# Altium project nova34.PrjPcb (part 1 of 2)
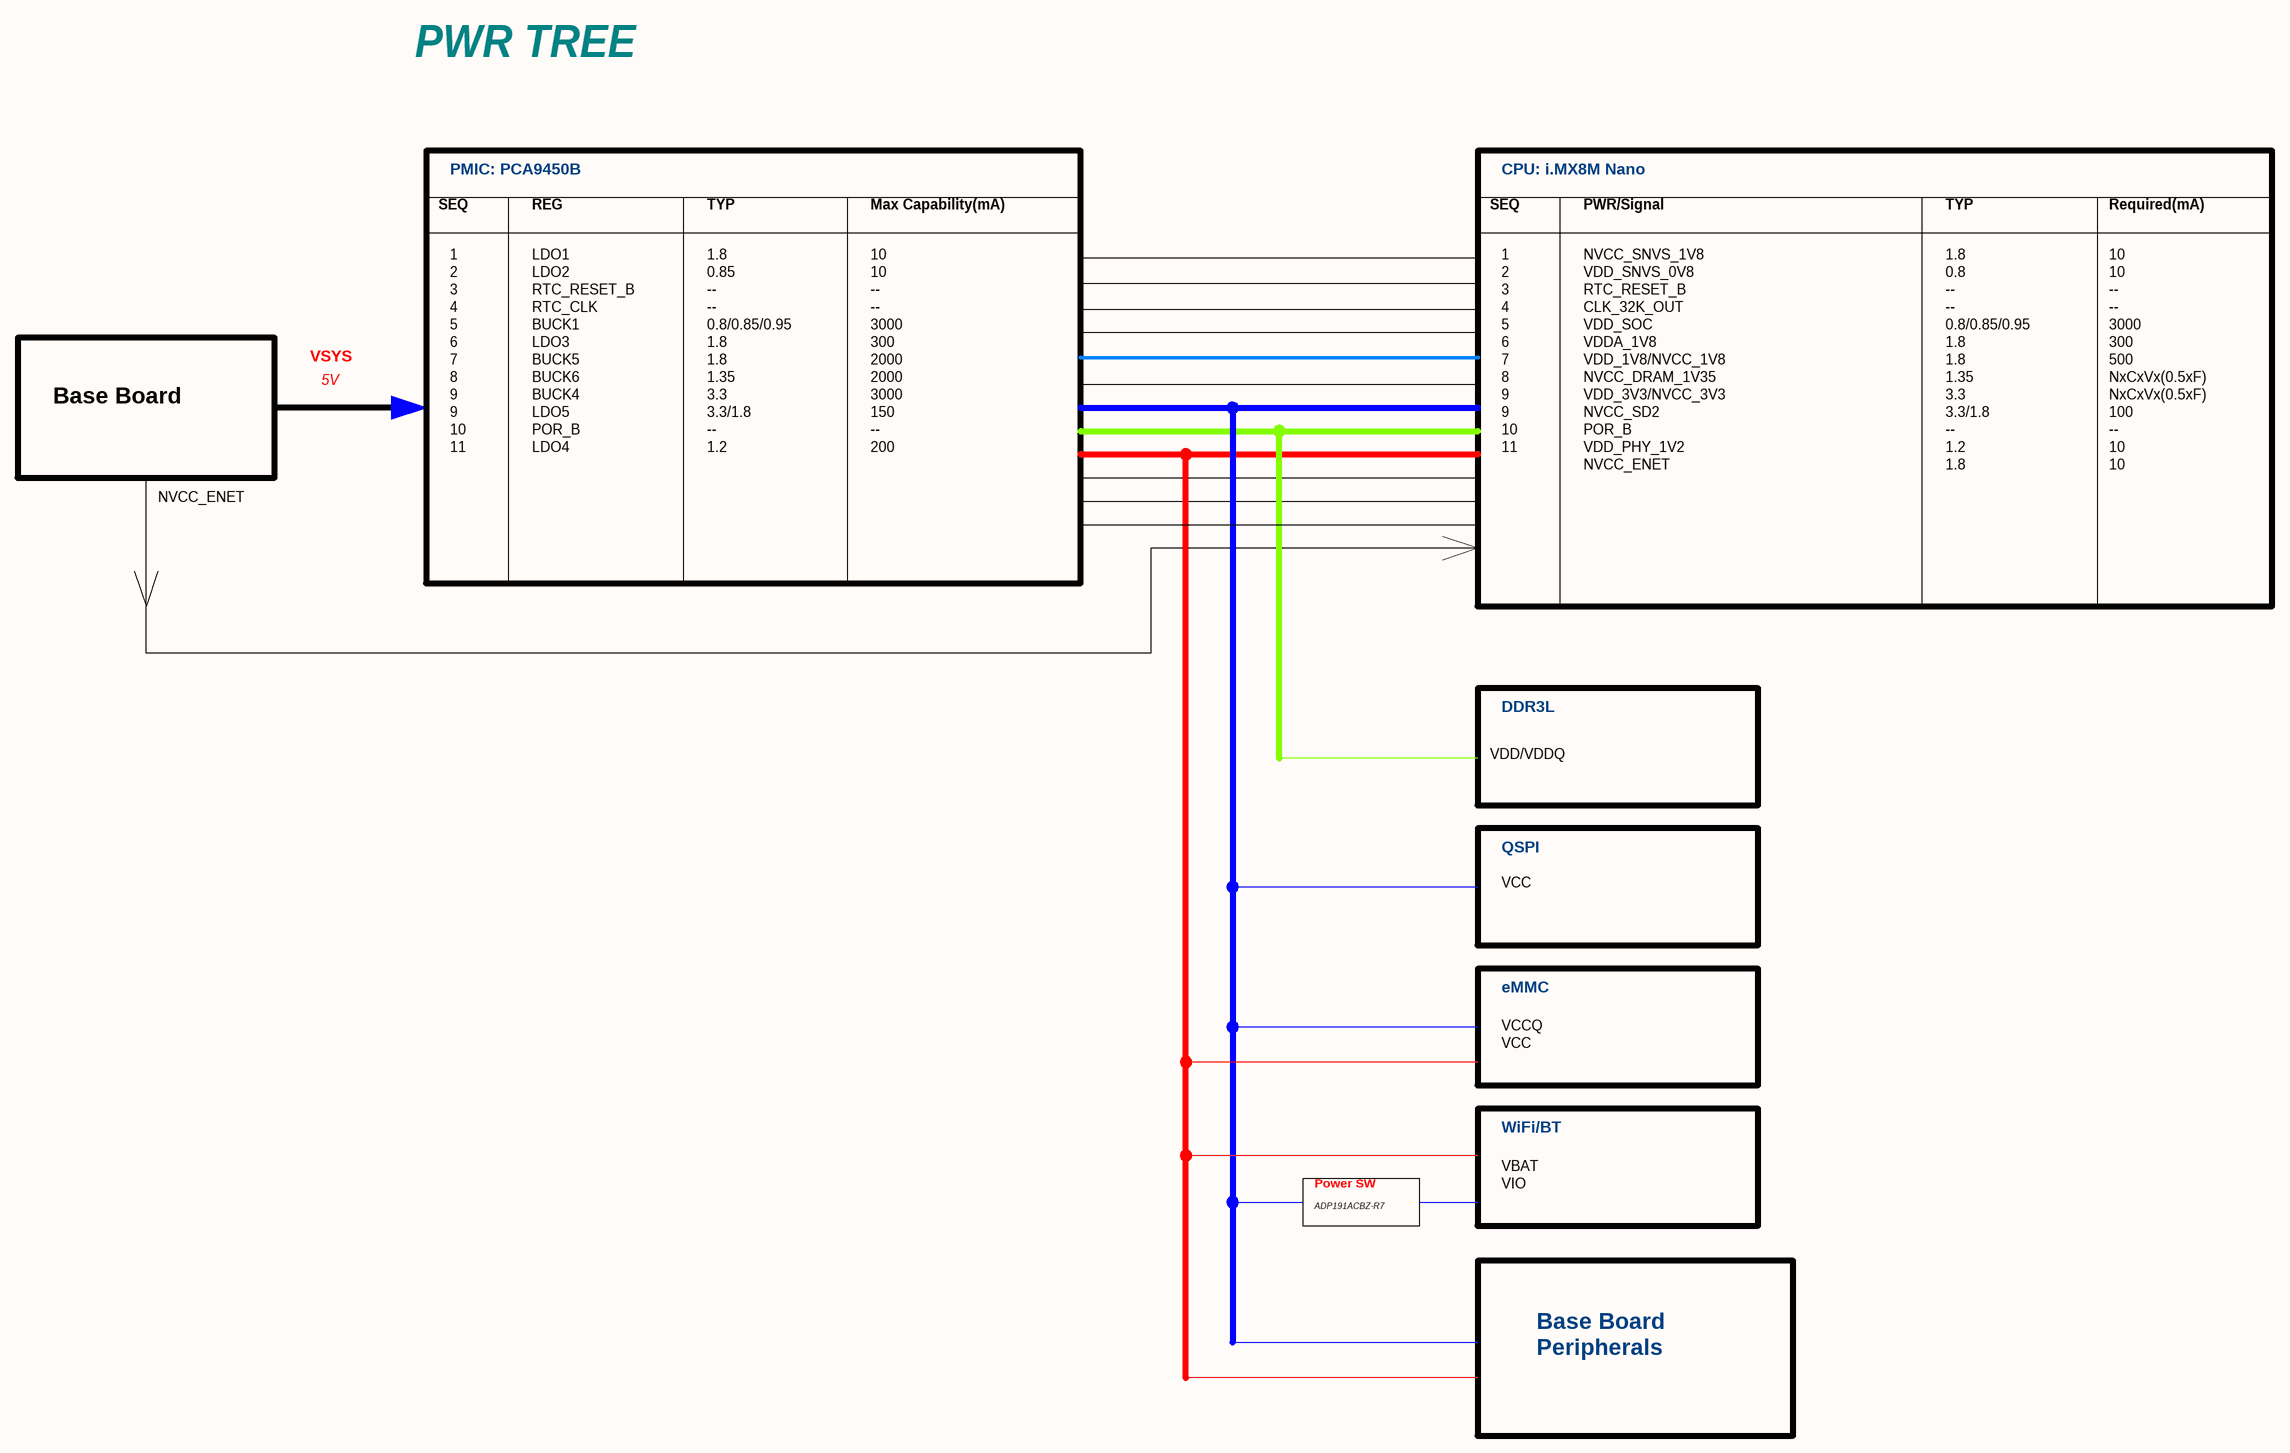
[diagram p0: Page03 PWR TREE.SchDoc]
10 sheets, 281 parts. Net scope: global (net labels, ports and power ports of the same name join across sheets).
Board file: nova34.PcbDoc
Sheets:
  Page03 PWR TREE.SchDoc
  Page04 CPU PWR.SchDoc
  Page05 DDR4L+eMMC.SchDoc
  Page06 CPU IO.SchDoc
  Page07 CPU PHY.SchDoc
  Page08 CPU MISC.SchDoc
  Page09 WIFI&Bluetooth.SchDoc
  Page10 BOOT_CFG.SchDoc
  Page11 PMIC PCA9450B.SchDoc
  Page12 SOM Interface.SchDoc

## Sheet Page03 PWR TREE.SchDoc
size 513 x 386 mm; SheetNumber: 1; SheetTotal: 11

### Notes on the sheet
- PWR TREE
- SEQ
- PMIC: PCA9450B
- REG
- TYP
- Max Capability(mA)
- CPU: i.MX8M Nano
- PWR/Signal
- Required(mA)
- VSYS
- Base Board
- 5V
- NVCC_ENET
- 1
  2
  3
  4
  5
  6
  7
  8
  9
  9
  10
  11
- LDO1
  LDO2
  RTC_RESET_B
  RTC_CLK
  BUCK1
  LDO3
  BUCK5
  BUCK6
  BUCK4
  LDO5
  POR_B
  LDO4
- 1.8
  0.85
  --
  --
  0.8/0.85/0.95
  1.8
  1.8
  1.35
  3.3
  3.3/1.8
  --
  1.2
- 10
  10
  --
  --
  3000
  300
  2000
  2000
  3000
  150
  --
  200
- NVCC_SNVS_1V8
  VDD_SNVS_0V8
  RTC_RESET_B
  CLK_32K_OUT
  VDD_SOC
  VDDA_1V8
  VDD_1V8/NVCC_1V8
  NVCC_DRAM_1V35
  VDD_3V3/NVCC_3V3
  NVCC_SD2
  POR_B
  VDD_PHY_1V2
  NVCC_ENET
- 1.8
  0.8
  --
  --
  0.8/0.85/0.95
  1.8
  1.8
  1.35
  3.3
  3.3/1.8
  --
  1.2
  1.8
- 10
  10
  --
  --
  3000
  300
  500
  NxCxVx(0.5xF)
  NxCxVx(0.5xF)
  100
  --
  10
  10
- DDR3L
- VDD/VDDQ
- VCC
- QSPI
- eMMC
- VCCQ
  VCC
- WiFi/BT
- Power SW
- VBAT
  VIO
- ADP191ACBZ-R7
- Base Board
  Peripherals

## Sheet Page04 CPU PWR.SchDoc
size 513 x 386 mm; SheetNumber: 2; SheetTotal: 11
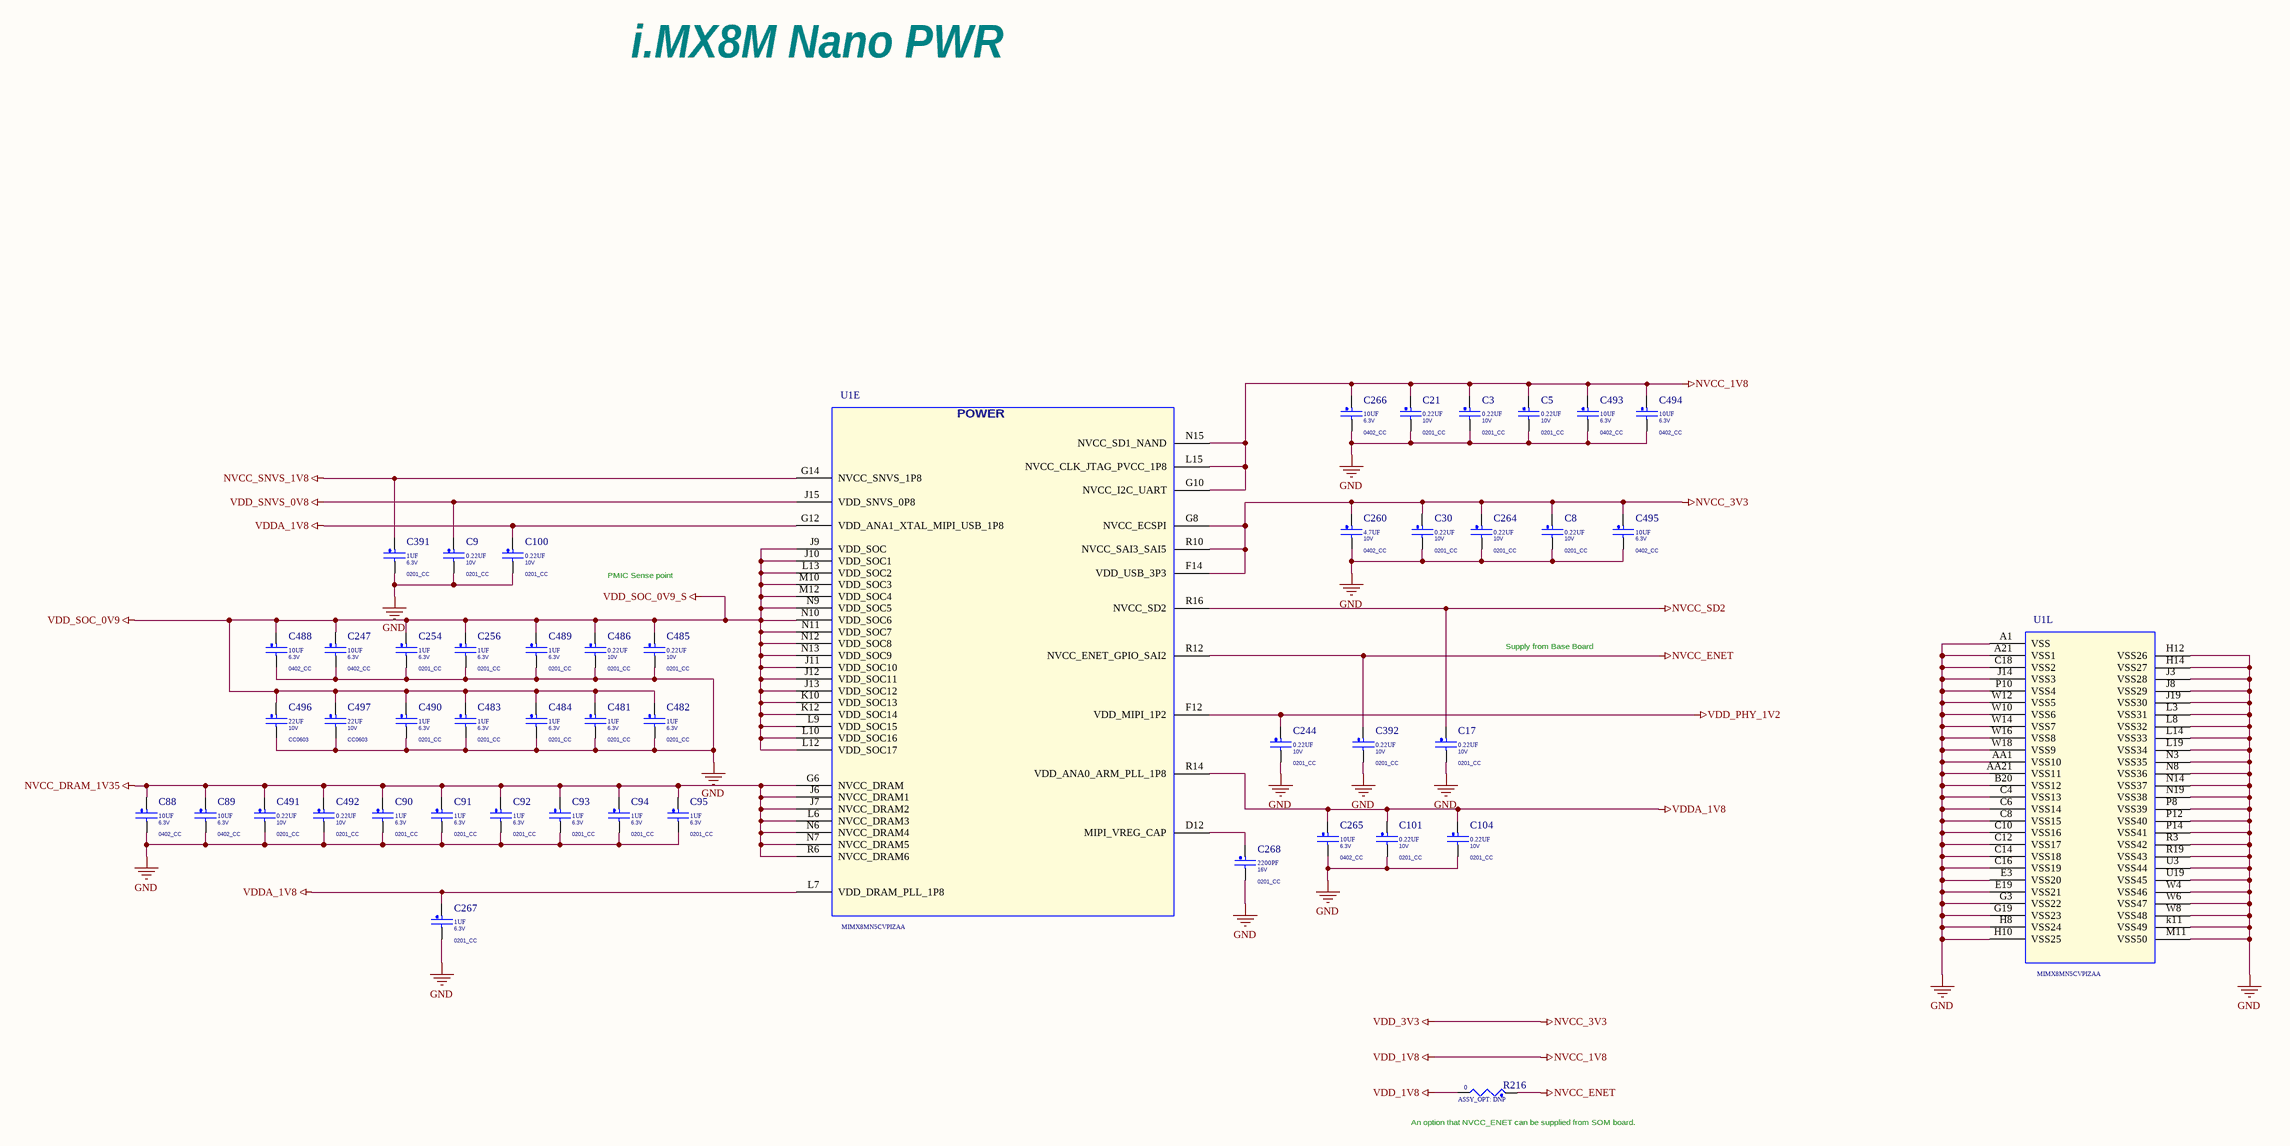
[diagram p1: Page04 CPU PWR.SchDoc]

### Parts
C3  0.22UF  VOLTAGE: 10V  PCB Footprint: 0201_CC  [0201_CC - C]
C5  0.22UF  VOLTAGE: 10V  PCB Footprint: 0201_CC  [0201_CC - C]
C8  0.22UF  VOLTAGE: 10V  PCB Footprint: 0201_CC  [0201_CC - C]
C9  0.22UF  VOLTAGE: 10V  PCB Footprint: 0201_CC  [0201_CC - C]
C17  0.22UF  VOLTAGE: 10V  PCB Footprint: 0201_CC  [0201_CC - C]
C21  0.22UF  VOLTAGE: 10V  PCB Footprint: 0201_CC  [0201_CC - C]
C30  0.22UF  VOLTAGE: 10V  PCB Footprint: 0201_CC  [0201_CC - C]
C88  10UF  PCB Footprint: 0402_CC  VOLTAGE: 6.3V  [0402_CC - C]
C89  10UF  PCB Footprint: 0402_CC  VOLTAGE: 6.3V  [0402_CC - C]
C90  1UF  PCB Footprint: 0201_CC  VOLTAGE: 6.3V  [0201_CC - C]
C91  1UF  PCB Footprint: 0201_CC  VOLTAGE: 6.3V  [0201_CC - C]
C92  1UF  PCB Footprint: 0201_CC  VOLTAGE: 6.3V  [0201_CC - C]
C93  1UF  PCB Footprint: 0201_CC  VOLTAGE: 6.3V  [0201_CC - C]
C94  1UF  PCB Footprint: 0201_CC  VOLTAGE: 6.3V  [0201_CC - C]
C95  1UF  PCB Footprint: 0201_CC  VOLTAGE: 6.3V  [0201_CC - C]
C100  0.22UF  VOLTAGE: 10V  PCB Footprint: 0201_CC  [0201_CC - C]
C101  0.22UF  VOLTAGE: 10V  PCB Footprint: 0201_CC  [0201_CC - C]
C104  0.22UF  VOLTAGE: 10V  PCB Footprint: 0201_CC  [0201_CC - C]
C244  0.22UF  VOLTAGE: 10V  PCB Footprint: 0201_CC  [0201_CC - C]
C247  10UF  VOLTAGE: 6.3V  PCB Footprint: 0402_CC  [0402_CC - C]
C254  1UF  VOLTAGE: 6.3V  PCB Footprint: 0201_CC  [0201_CC - C]
C256  1UF  VOLTAGE: 6.3V  PCB Footprint: 0201_CC  [0201_CC - C]
C260  4.7UF  VOLTAGE: 10V  PCB Footprint: 0402_CC  [0402_CC - C]
C264  0.22UF  VOLTAGE: 10V  PCB Footprint: 0201_CC  [0201_CC - C]
C265  10UF  VOLTAGE: 6.3V  PCB Footprint: 0402_CC  [0402_CC - C]
C266  10UF  VOLTAGE: 6.3V  PCB Footprint: 0402_CC  [0402_CC - C]
C267  1UF  VOLTAGE: 6.3V  PCB Footprint: 0201_CC  [0201_CC - C]
C268  2200PF  VOLTAGE: 16V  PCB Footprint: 0201_CC  [0201_CC - C]
C391  1UF  VOLTAGE: 6.3V  PCB Footprint: 0201_CC  [0201_CC - C]
C392  0.22UF  VOLTAGE: 10V  PCB Footprint: 0201_CC  [0201_CC - C]
C481  1UF  VOLTAGE: 6.3V  PCB Footprint: 0201_CC  [0201_CC - C]
C482  1UF  VOLTAGE: 6.3V  PCB Footprint: 0201_CC  [0201_CC - C]
C483  1UF  VOLTAGE: 6.3V  PCB Footprint: 0201_CC  [0201_CC - C]
C484  1UF  VOLTAGE: 6.3V  PCB Footprint: 0201_CC  [0201_CC - C]
C485  0.22UF  VOLTAGE: 10V  PCB Footprint: 0201_CC  [0201_CC - C]
C486  0.22UF  VOLTAGE: 10V  PCB Footprint: 0201_CC  [0201_CC - C]
C488  10UF  VOLTAGE: 6.3V  PCB Footprint: 0402_CC  [0402_CC - C]
C489  1UF  VOLTAGE: 6.3V  PCB Footprint: 0201_CC  [0201_CC - C]
C490  1UF  VOLTAGE: 6.3V  PCB Footprint: 0201_CC  [0201_CC - C]
C491  0.22UF  PCB Footprint: 0201_CC  VOLTAGE: 10V  [0201_CC - C]
C492  0.22UF  PCB Footprint: 0201_CC  VOLTAGE: 10V  [0201_CC - C]
C493  10UF  VOLTAGE: 6.3V  PCB Footprint: 0402_CC  [0402_CC - C]
C494  10UF  VOLTAGE: 6.3V  PCB Footprint: 0402_CC  [0402_CC - C]
C495  10UF  VOLTAGE: 6.3V  PCB Footprint: 0402_CC  [0402_CC - C]
C496  22UF  VOLTAGE: 10V  PCB Footprint: CC0603  [0603_CC]
C497  22UF  VOLTAGE: 10V  PCB Footprint: CC0603  [0603_CC]
R216  0  ASSY_OPT: DNP  [0402_CC_RES]
U1  MIMX8MN5CVPIZAA  [BGA306C50P21X21_1100X1100X101]  (parts E,L of 12)

### Nets
GND: C3.2 C5.2 C8.2 C9.2 C17.2 C21.2 C30.2 C88.2 C89.2 C90.2 C91.2 C92.2 C93.2 C94.2 C95.2 C100.2 C101.2 C104.2 C244.2 C247.2 C254.2 C256.2 C260.2 C264.2 C265.2 C266.2 C267.2 C268.2 C391.2 C392.2 C481.2 C482.2 C483.2 C484.2 C485.2 C486.2 C488.2 C489.2 C490.2 C491.2 C492.2 C493.2 C494.2 C495.2 C496.2 C497.2 U1.A1(VSS) U1.A21(VSS1) U1.AA1(VSS10) U1.AA21(VSS11) U1.B20(VSS12) U1.C4(VSS13) U1.C6(VSS14) U1.C8(VSS15) U1.C10(VSS16) U1.C12(VSS17) U1.C14(VSS18) U1.C16(VSS19) U1.C18(VSS2) U1.E3(VSS20) U1.E19(VSS21) U1.G3(VSS22) U1.G19(VSS23) U1.H8(VSS24) U1.H10(VSS25) U1.H12(VSS26) U1.H14(VSS27) U1.J3(VSS28) U1.J8(VSS29) U1.J14(VSS3) U1.J19(VSS30) U1.k11(VSS49) U1.L3(VSS31) U1.L8(VSS32) U1.L14(VSS33) U1.L19(VSS34) U1.M11(VSS50) U1.N3(VSS35) U1.N8(VSS36) U1.N14(VSS37) U1.N19(VSS38) U1.P8(VSS39) U1.P10(VSS4) U1.P12(VSS40) U1.P14(VSS41) U1.R3(VSS42) U1.R19(VSS43) U1.U3(VSS44) U1.U19(VSS45) U1.W4(VSS46) U1.W6(VSS47) U1.W8(VSS48) U1.W10(VSS6) U1.W12(VSS5) U1.W14(VSS7) U1.W16(VSS8) U1.W18(VSS9)
NVCC_DRAM_1V35: C88.1 C89.1 C90.1 C91.1 C92.1 C93.1 C94.1 C95.1 C491.1 C492.1 U1.G6(NVCC_DRAM) U1.J6(NVCC_DRAM1) U1.J7(NVCC_DRAM2) U1.L6(NVCC_DRAM3) U1.N6(NVCC_DRAM4) U1.N7(NVCC_DRAM5) U1.R6(NVCC_DRAM6)
NVCC_ENET: C392.1 R216.1 U1.R12(NVCC_ENET_GPIO_SAI2)
NVCC_SD2: C17.1 U1.R16(NVCC_SD2)
NVCC_SNVS_1V8: C391.1 U1.G14(NVCC_SNVS_1P8)
VDD_1V8: C3.1 C5.1 C21.1 C266.1 C493.1 C494.1 R216.2 U1.G10(NVCC_I2C_UART) U1.L15(NVCC_CLK_JTAG_PVCC_1P8) U1.N15(NVCC_SD1_NAND)  [also labelled NVCC_1V8]
VDD_3V3: C8.1 C30.1 C260.1 C264.1 C495.1 U1.F14(VDD_USB_3P3) U1.G8(NVCC_ECSPI) U1.R10(NVCC_SAI3_SAI5)  [also labelled NVCC_3V3]
VDD_PHY_1V2: C244.1 U1.F12(VDD_MIPI_1P2)
VDD_SNVS_0V8: C9.1 U1.J15(VDD_SNVS_0P8)
VDD_SOC_0V9: C247.1 C254.1 C256.1 C481.1 C482.1 C483.1 C484.1 C485.1 C486.1 C488.1 C489.1 C490.1 C496.1 C497.1 U1.J9(VDD_SOC) U1.J10(VDD_SOC1) U1.J11(VDD_SOC10) U1.J12(VDD_SOC11) U1.J13(VDD_SOC12) U1.K10(VDD_SOC13) U1.K12(VDD_SOC14) U1.L9(VDD_SOC15) U1.L10(VDD_SOC16) U1.L12(VDD_SOC17) U1.L13(VDD_SOC2) U1.M10(VDD_SOC3) U1.M12(VDD_SOC4) U1.N9(VDD_SOC5) U1.N10(VDD_SOC6) U1.N11(VDD_SOC7) U1.N12(VDD_SOC8) U1.N13(VDD_SOC9)  [also labelled VDD_SOC_0V9_S]
VDDA_1V8: C100.1 C101.1 C104.1 C265.1 C267.1 U1.G12(VDD_ANA1_XTAL_MIPI_USB_1P8) U1.L7(VDD_DRAM_PLL_1P8) U1.R14(VDD_ANA0_ARM_PLL_1P8)
NetC268_1: C268.1 U1.D12(MIPI_VREG_CAP)

### Notes on the sheet
- i.MX8M Nano PWR
- PMIC Sense point
- Supply from Base Board
- (near R216) An option that NVCC_ENET can be supplied from SOM board.
- (in symbol MIMX8MN, part E) POWER

### Library data of the parts
C3 C9 C104 C392 C485 C486 = CAP_NP: CAP CER 0.22UF 10V 20% X5R 0201; CLASS: DISCRETE; FPLIST: CC0201,CC0201_HD,0201_CC; CAD_APPROVED: Yes; MFG_PN01: LMK063BJ224MP-F; MFG_NAME01: Taiyo Yuden; AGILE_PN: 150-78815; HEIGHT: 0.33MM; ROHS: Yes; Tolerance: 20%
C5 C8 C17 C21 C100 C101 C264 C491 C492 = CAP_NP: CAP CER 0.22UF 10V 20% X5R 0201; CLASS: DISCRETE; AGILE_PN: 150-78815; MFG_NAME01: Taiyo Yuden; MFG_PN01: LMK063BJ224MP-F; CAD_APPROVED: Yes; FPLIST: CC0201,CC0201_HD,0201_CC; Tolerance: 20%; ROHS: Yes; HEIGHT: 0.33MM
C30 = CAP_NP: CAP CER 0.22UF 10V 20% X5R 0201; CLASS: DISCRETE; FPLIST: CC0201,CC0201_HD,0201_CC,0201_CC_012SM_NSP; CAD_APPROVED: Yes; MFG_PN01: LMK063BJ224MP-F; MFG_NAME01: Taiyo Yuden; AGILE_PN: 150-78815; HEIGHT: 0.33MM; ROHS: Yes; Tolerance: 20%
C88 C265 C266 C493 C494 = CAP_NP: CAP CER 10UF 6.3V 20% X5R 0402; CLASS: DISCRETE; AGILE_PN: 150-79163; MFG_NAME01: SAMSUNG ELECTRO MECHANICS; MFG_PN01: CL05A106MQ5NUNC; CAD_APPROVED: Yes; FPLIST: CC0402_25,CC0402_HD,0402_CC; Tolerance: 20%; ROHS: Yes; HEIGHT: 0.65 MM
C89 C247 C488 C495 = CAP_NP: CAP CER 10UF 6.3V 20% X5R 0402; CLASS: DISCRETE; FPLIST: CC0402_25,CC0402_HD,0402_CC; CAD_APPROVED: Yes; MFG_PN01: CL05A106MQ5NUNC; MFG_NAME01: SAMSUNG ELECTRO MECHANICS; AGILE_PN: 150-79163; HEIGHT: 0.65 MM; ROHS: Yes; Tolerance: 20%
C90-C92 C95 C254 C391 C481-C484 C489 C490 = CAP_NP: CAP CER 1uF 6.3V 20% X5R 0201; CLASS: DISCRETE; FPLIST: CC0201,CC0201_HD,0201_CC,0201_CC_012SM_NSP; CAD_APPROVED: Yes; MFG_PN01: 02016D105MAT2A; MFG_NAME01: AVX; AGILE_PN: 150-79407; Package Type: 7¡± reel; Package Size: 0201; HEIGHT: 0.35MM; ROHS: Yes; Tolerance: 20%
C93 C94 C256 C267 = CAP_NP: CAP CER 1uF 6.3V 20% X5R 0201; CLASS: DISCRETE; AGILE_PN: 150-79407; MFG_NAME01: AVX; MFG_PN01: 02016D105MAT2A; CAD_APPROVED: Yes; FPLIST: CC0201,CC0201_HD,0201_CC,0201_CC_012SM_NSP; Package Type: 7¡± reel; Package Size: 0201; Tolerance: 20%; ROHS: Yes; HEIGHT: 0.35MM
C244 = CAP_NP: CAP CER 0.22UF 10V 20% X5R 0201; CLASS: DISCRETE; FPLIST: CC0201,CC0201_HD,0201_CC,CC_0201_CIR,0201_CC_012SM_NSP; CAD_APPROVED: Yes; MFG_PN01: LMK063BJ224MP-F; MFG_NAME01: Taiyo Yuden; AGILE_PN: 150-78815; HEIGHT: 0.33MM; ROHS: Yes; Tolerance: 20%
C260 = CAP_NP: CAP CER 4.7uF 10V 10% X5R 0402; CLASS: DISCRETE; AGILE_PN: 150-80044; MFG_NAME01: Samsung Electro Mechanics; MFG_PN01: CL05A475KP5NRNC; CAD_APPROVED: Yes; FPLIST: CC0402_25,CC0402_HD,0402_CC; Tolerance: 10%; ROHS: Yes; HEIGHT: 0.65MM
C268 = CAP_NP: CAP CER 2200PF 16V 10% X7R 0201; CLASS: DISCRETE; AGILE_PN: 150-78660; Tolerance: 20%; MFG_NAME01: MURATA; MFG_PN01: GRM033R71C222KA88D; CAD_APPROVED: Yes; FPLIST: CC0201,CC0201_HD,0201_CC; ROHS: Yes; HEIGHT: 0.33 MM
C496 C497 = CAP_NP: CAP CER 22uF 10V 20% X5R 0603; CLASS: DISCRETE; WVDC: 6.3V; AGILE_PN: 150-79530; MFG_NAME01: TDK; MFG_PN01: C1608X5R1A226M080AC; CAD_APPROVED: Yes; FPLIST: CC0603_OV,CC0603,0603_CC; SIGNAL_MODEL: DEFAULT_CAPACITOR_2.2e+07pF_2_1; Package Size: 0603; Tolerance: 20%; ROHS: Yes; HEIGHT: 1MM
R216 = RES: RES MF ZERO OHM 1/16W 5% 0402; CLASS: DISCRETE; AGILE_PN: 470-75394; MFG_NAME01: YAGEO AMERICA; MFG_PN01: RC0402JR-070RL; CAD_APPROVED: Yes; FPLIST: RC0402_25,RC0402_HD,RC0402_X2,0402_CC; PCB Footprint: 0402_CC; Tolerance: 5%; ROHS: Yes; HEIGHT: 0.45 MM; VOLTAGE: 1/16W
U1 = MIMX8MN: IC CPU QUAD CORTEX A53+M7 1.4GHZ -- BGA306; PCB Footprint: pbga306_0p5_sq11mm; AGILE_PN: TMP-CIP-5098; CAD_APPROVED: Yes; PRE_APN: 330-77152; Temp Range: -40¡ãC to 105¡ãC; MFG_NAME01: NXP SEMICONDUCTORS; CLASS: IC; HEIGHT: 1.01MM; ROHS: Yes; MFG_PN01: MIMX8MN5CVPIZAA

## Sheet Page05 DDR4L+eMMC.SchDoc
size 513 x 386 mm; SheetNumber: 3; SheetTotal: 11
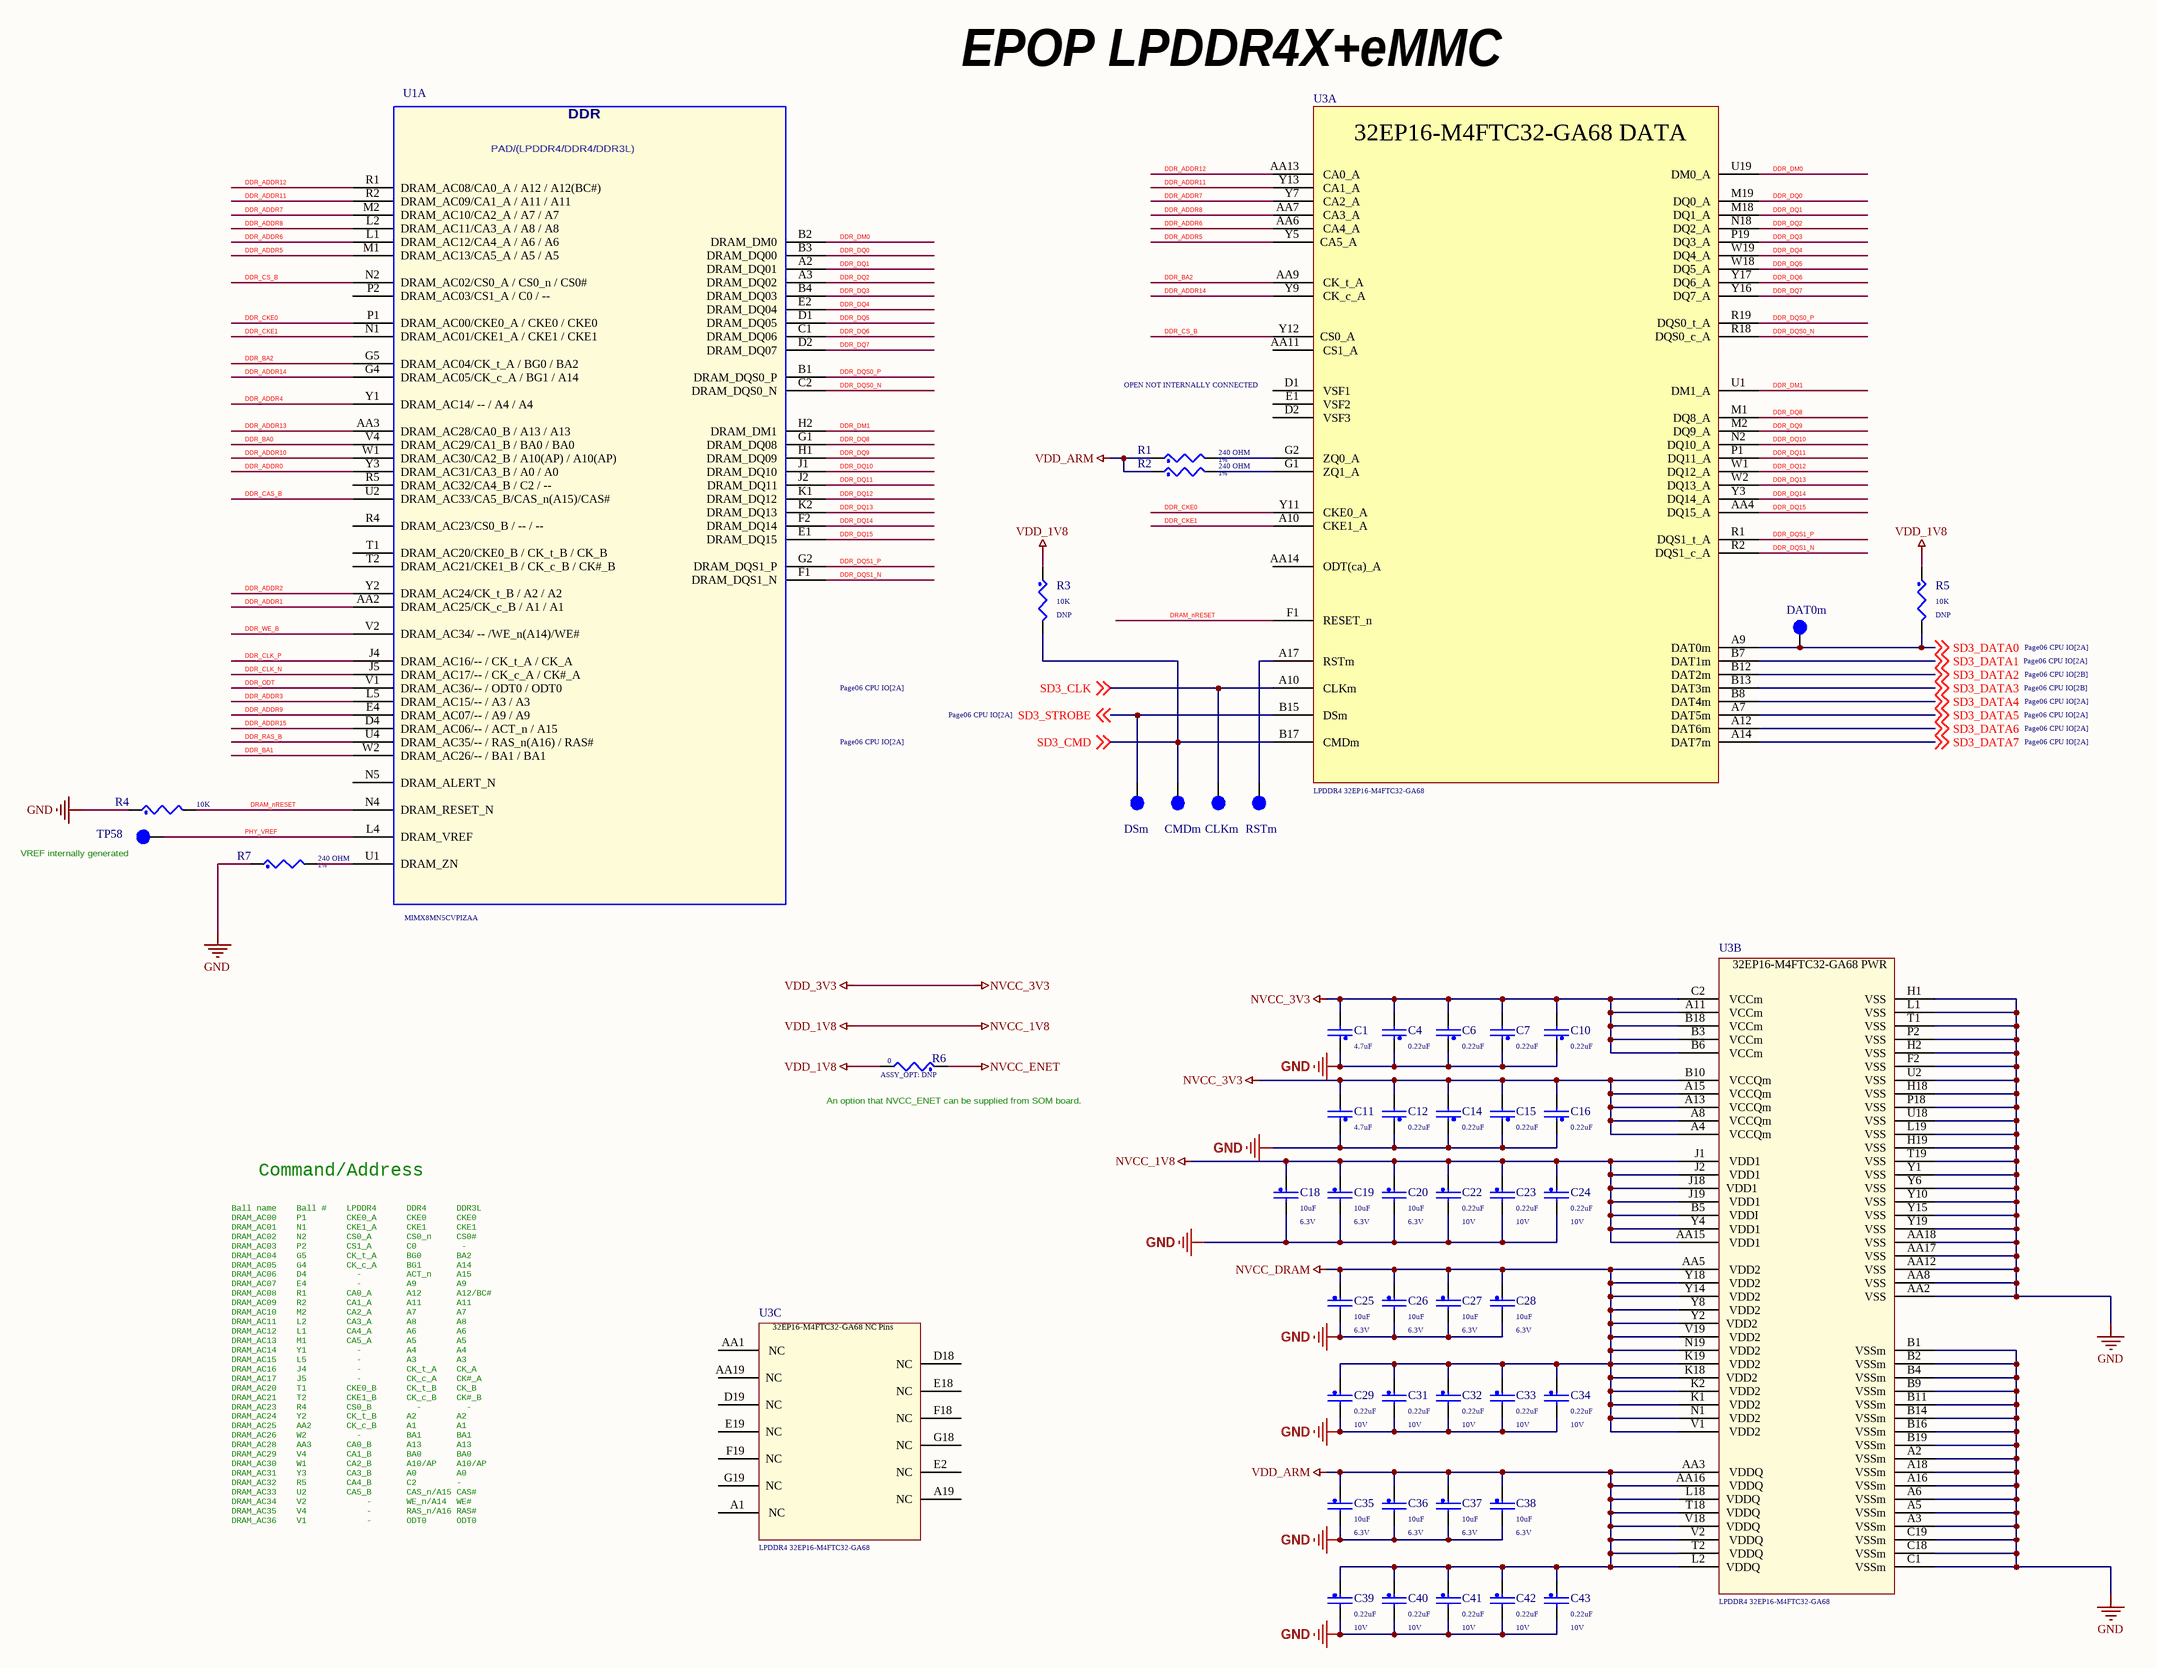
[diagram p2: Page05 DDR4L+eMMC.SchDoc]

### Parts
C1  4.7uF  [0402_CC - C]
C4  0.22uF  [0201_CC - C]
C6  0.22uF  [0201_CC - C]
C7  0.22uF  [0201_CC - C]
C10  0.22uF  [0201_CC - C]
C11  4.7uF  [0402_CC - C]
C12  0.22uF  [0201_CC - C]
C14  0.22uF  [0201_CC - C]
C15  0.22uF  [0201_CC - C]
C16  0.22uF  [0201_CC - C]
C18  10uF  Voltage: 6.3V  [0402_CC - C]
C19  10uF  Voltage: 6.3V  [0402_CC - C]
C20  10uF  Voltage: 6.3V  [0402_CC - C]
C22  0.22uF  Voltage: 10V  [0201_CC - C]
C23  0.22uF  Voltage: 10V  [0201_CC - C]
C24  0.22uF  Voltage: 10V  [0201_CC - C]
C25  10uF  Voltage: 6.3V  [0402_CC - C]
C26  10uF  Voltage: 6.3V  [0402_CC - C]
C27  10uF  Voltage: 6.3V  [0402_CC - C]
C28  10uF  Voltage: 6.3V  [0402_CC - C]
C29  0.22uF  Voltage: 10V  [0201_CC - C]
C31  0.22uF  Voltage: 10V  [0201_CC - C]
C32  0.22uF  Voltage: 10V  [0201_CC - C]
C33  0.22uF  Voltage: 10V  [0201_CC - C]
C34  0.22uF  Voltage: 10V  [0201_CC - C]
C35  10uF  Voltage: 6.3V  [0402_CC - C]
C36  10uF  Voltage: 6.3V  [0402_CC - C]
C37  10uF  Voltage: 6.3V  [0402_CC - C]
C38  10uF  Voltage: 6.3V  [0402_CC - C]
C39  0.22uF  Voltage: 10V  [0201_CC - C]
C40  0.22uF  Voltage: 10V  [0201_CC - C]
C41  0.22uF  Voltage: 10V  [0201_CC - C]
C42  0.22uF  Voltage: 10V  [0201_CC - C]
C43  0.22uF  Voltage: 10V  [0201_CC - C]
CLKm  tpad_020  [Test Pin]  (value not drawn)  (graphical)
CMDm  TPAD_015  [Test Pin]  (value not drawn)  (graphical)
DAT0m  tpad_020  [Test Pin]  (value not drawn)  (graphical)
DSm  TPAD_015  [Test Pin]  (value not drawn)  (graphical)
R1  240 OHM  Tolerance: 1%  [0201_RES]
R2  240 OHM  Tolerance: 1%  [0201_RES]
R3  10K  ASSY_OPT: DNP  [0201_RES]
R4  10K  [0201_RES]
R5  10K  ASSY_OPT: DNP  [0201_RES]
R6  0  ASSY_OPT: DNP  [0402_CC_RES]
R7  240 OHM  Tolerance: 1%  [0201_RES]
RSTm  tpad_020  [Test Pin]  (value not drawn)  (graphical)
TP58  tpad_020  [Test Pin]  (value not drawn)  (graphical)
U1  MIMX8MN5CVPIZAA  [BGA306C50P21X21_1100X1100X101]  (part A of 12)
U3  LPDDR4 32EP16-M4FTC32-GA68  [FBGA144C40P19X21_800X950X80]  (parts A,B,C of 3)

### Nets
GND: C1.1 C4.1 C6.1 C7.1 C10.1 C11.1 C12.1 C14.1 C15.1 C16.1 C18.2 C19.2 C20.2 C22.2 C23.2 C24.2 C25.2 C26.2 C27.2 C28.2 C29.2 C31.2 C32.2 C33.2 C34.2 C35.2 C36.2 C37.2 C38.2 C39.2 C40.2 C41.2 C42.2 C43.2 R4.1 R7.1 U3.A2(VSSm) U3.A3(VSSm) U3.A5(VSSm) U3.A6(VSSm) U3.A16(VSSm) U3.A18(VSSm) U3.AA2(VSS) U3.AA8(VSS) U3.AA12(VSS) U3.AA17(VSS) U3.AA18(VSS) U3.B1(VSSm) U3.B2(VSSm) U3.B4(VSSm) U3.B9(VSSm) U3.B11(VSSm) U3.B14(VSSm) U3.B16(VSSm) U3.B19(VSSm) U3.C1(VSSm) U3.C18(VSSm) U3.C19(VSSm) U3.F2(VSS) U3.H1(VSS) U3.H2(VSS) U3.H18(VSS) U3.H19(VSS) U3.L1(VSS) U3.L19(VSS) U3.P2(VSS) U3.P18(VSS) U3.T1(VSS) U3.T19(VSS) U3.U2(VSS) U3.U18(VSS) U3.Y1(VSS) U3.Y6(VSS) U3.Y10(VSS) U3.Y15(VSS) U3.Y19(VSS)
NVCC_DRAM: C25.1 C26.1 C27.1 C28.1 C29.1 C31.1 C32.1 C33.1 C34.1 U3.AA5(VDD2) U3.K1(VDD2) U3.K2(VDD2) U3.K18(VDD2) U3.K19(VDD2) U3.N1(VDD2) U3.N19(VDD2) U3.V1(VDD2) U3.V19(VDD2) U3.Y2(VDD2) U3.Y8(VDD2) U3.Y14(VDD2) U3.Y18(VDD2)
NVCC_ENET: R6.1
VDD_1V8: C18.1 C19.1 C20.1 C22.1 C23.1 C24.1 R3.1 R5.1 R6.2 U3.AA15(VDD1) U3.B5(VDDI) U3.J1(VDD1) U3.J2(VDD1) U3.J18(VDD1) U3.J19(VDD1) U3.Y4(VDD1)  [also labelled NVCC_1V8]
VDD_3V3: C1.2 C4.2 C6.2 C7.2 C10.2 C11.2 C12.2 C14.2 C15.2 C16.2 U3.A4(VCCQm) U3.A8(VCCQm) U3.A11(VCCm) U3.A13(VCCQm) U3.A15(VCCQm) U3.B3(VCCm) U3.B6(VCCm) U3.B10(VCCQm) U3.B18(VCCm) U3.C2(VCCm)  [also labelled NVCC_3V3]
VDD_ARM: C35.1 C36.1 C37.1 C38.1 C39.1 C40.1 C41.1 C42.1 C43.1 R1.1 R2.1 U3.AA3(VDDQ) U3.AA16(VDDQ) U3.L2(VDDQ) U3.L18(VDDQ) U3.T2(VDDQ) U3.T18(VDDQ) U3.V2(VDDQ) U3.V18(VDDQ)
DDR_ADDR0: U1.Y3(DRAM_AC31/CA3_B_/_A0_/_A0)
DDR_ADDR1: U1.AA2(DRAM_AC25/CK_c_B_/_A1_/_A1)
DDR_ADDR2: U1.Y2(DRAM_AC24/CK_t_B_/_A2_/_A2)
DDR_ADDR3: U1.L5(DRAM_AC15/--_/_A3_/_A3)
DDR_ADDR4: U1.Y1(DRAM_AC14/_--_/_A4_/_A4)
DDR_ADDR5: U1.M1(DRAM_AC13/CA5_A_/_A5_/_A5) U3.Y5(CA5_A)
DDR_ADDR6: U1.L1(DRAM_AC12/CA4_A_/_A6_/_A6) U3.AA6(CA4_A)
DDR_ADDR7: U1.M2(DRAM_AC10/CA2_A_/_A7_/_A7) U3.Y7(CA2_A)
DDR_ADDR8: U1.L2(DRAM_AC11/CA3_A_/_A8_/_A8) U3.AA7(CA3_A)
DDR_ADDR9: U1.E4(DRAM_AC07/--_/_A9_/_A9)
DDR_ADDR10: U1.W1(DRAM_AC30/CA2_B_/_A10(AP)_/_A10(AP))
DDR_ADDR11: U1.R2(DRAM_AC09/CA1_A_/_A11_/_A11) U3.Y13(CA1_A)
DDR_ADDR12: U1.R1(DRAM_AC08/CA0_A_/_A12_/_A12(BC#)) U3.AA13(CA0_A)
DDR_ADDR13: U1.AA3(DRAM_AC28/CA0_B_/_A13_/_A13)
DDR_ADDR14: U1.G4(DRAM_AC05/CK_c_A_/_BG1_/_A14) U3.Y9(CK_c_A)
DDR_ADDR15: U1.D4(DRAM_AC06/--_/_ACT_n_/_A15)
DDR_BA0: U1.V4(DRAM_AC29/CA1_B_/_BA0_/_BA0)
DDR_BA1: U1.W2(DRAM_AC26/--_/_BA1_/_BA1)
DDR_BA2: U1.G5(DRAM_AC04/CK_t_A_/_BG0_/_BA2) U3.AA9(CK_t_A)
DDR_CAS_B: U1.U2(DRAM_AC33/CA5_B/CAS_n(A15)/CAS#)
DDR_CKE0: U1.P1(DRAM_AC00/CKE0_A_/_CKE0_/_CKE0) U3.Y11(CKE0_A)
DDR_CKE1: U1.N1(DRAM_AC01/CKE1_A_/_CKE1_/_CKE1) U3.A10(CKE1_A)
DDR_CLK_N: U1.J5(DRAM_AC17/--_/_CK_c_A_/_CK#_A)
DDR_CLK_P: U1.J4(DRAM_AC16/--_/_CK_t_A_/_CK_A)
DDR_CS_B: U1.N2(DRAM_AC02/CS0_A_/_CS0_n_/_CS0#) U3.Y12(CS0_A)
DDR_DM0: U1.B2(DRAM_DM0) U3.U19(DM0_A)
DDR_DM1: U1.H2(DRAM_DM1) U3.U1(DM1_A)
DDR_DQ0: U1.B3(DRAM_DQ00) U3.M19(DQ0_A)
DDR_DQ1: U1.A2(DRAM_DQ01) U3.M18(DQ1_A)
DDR_DQ2: U1.A3(DRAM_DQ02) U3.N18(DQ2_A)
DDR_DQ3: U1.B4(DRAM_DQ03) U3.P19(DQ3_A)
DDR_DQ4: U1.E2(DRAM_DQ04) U3.W19(DQ4_A)
DDR_DQ5: U1.D1(DRAM_DQ05) U3.W18(DQ5_A)
DDR_DQ6: U1.C1(DRAM_DQ06) U3.Y17(DQ6_A)
DDR_DQ7: U1.D2(DRAM_DQ07) U3.Y16(DQ7_A)
DDR_DQ8: U1.G1(DRAM_DQ08) U3.M1(DQ8_A)
DDR_DQ9: U1.H1(DRAM_DQ09) U3.M2(DQ9_A)
DDR_DQ10: U1.J1(DRAM_DQ10) U3.N2(DQ10_A)
DDR_DQ11: U1.J2(DRAM_DQ11) U3.P1(DQ11_A)
DDR_DQ12: U1.K1(DRAM_DQ12) U3.W1(DQ12_A)
DDR_DQ13: U1.K2(DRAM_DQ13) U3.W2(DQ13_A)
DDR_DQ14: U1.F2(DRAM_DQ14) U3.Y3(DQ14_A)
DDR_DQ15: U1.E1(DRAM_DQ15) U3.AA4(DQ15_A)
DDR_DQS0_N: U1.C2(DRAM_DQS0_N) U3.R18(DQS0_c_A)
DDR_DQS0_P: U1.B1(DRAM_DQS0_P) U3.R19(DQS0_t_A)
DDR_DQS1_N: U1.F1(DRAM_DQS1_N) U3.R2(DQS1_c_A)
DDR_DQS1_P: U1.G2(DRAM_DQS1_P) U3.R1(DQS1_t_A)
DDR_ODT: U1.V1(DRAM_AC36/--_/_ODT0_/_ODT0)
DDR_RAS_B: U1.U4(DRAM_AC35/--_/_RAS_n(A16)_/_RAS#)
DDR_WE_B: U1.V2(DRAM_AC34/_--_/WE_n(A14)/WE#)
DRAM_nRESET: R4.2 U1.N4(DRAM_RESET_N) U3.F1(RESET_n)
PHY_VREF: TP58.1(Pin1) U1.L4(DRAM_VREF)
SD3_CLK: CLKm.1(Pin1) U3.A10(CLKm) ; off-sheet SD3_CLK
SD3_CMD: CMDm.1(Pin1) R3.2 U3.B17(CMDm) ; off-sheet SD3_CMD
SD3_DATA0: DAT0m.1(Pin1) R5.2 U3.A9(DAT0m) ; off-sheet SD3_DATA0
SD3_DATA1: U3.B7(DAT1m) ; off-sheet SD3_DATA1
SD3_DATA2: U3.B12(DAT2m) ; off-sheet SD3_DATA2
SD3_DATA3: U3.B13(DAT3m) ; off-sheet SD3_DATA3
SD3_DATA4: U3.B8(DAT4m) ; off-sheet SD3_DATA4
SD3_DATA5: U3.A7(DAT5m) ; off-sheet SD3_DATA5
SD3_DATA6: U3.A12(DAT6m) ; off-sheet SD3_DATA6
SD3_DATA7: U3.A14(DAT7m) ; off-sheet SD3_DATA7
SD3_STROBE: DSm.1(Pin1) U3.B15(DSm) ; off-sheet SD3_STROBE
NetR1_2: R1.2 U3.G2(ZQ0_A)
NetR2_2: R2.2 U3.G1(ZQ1_A)
NetR7_2: R7.2 U1.U1(DRAM_ZN)
NetRSTm_1: RSTm.1(Pin1) U3.A17(RSTm)

Not connected (* = marked no-connect by the designer): U1 N5(DRAM_ALERT_N) P2(DRAM_AC03/CS1_A_/_C0_/_--) R4(DRAM_AC23/CS0_B_/_--_/_--) R5(DRAM_AC32/CA4_B_/_C2_/_--) T1(DRAM_AC20/CKE0_B_/_CK_t_B_/_CK_B) T2(DRAM_AC21/CKE1_B_/_CK_c_B_/_CK#_B); U3 A1(_NC) A19(NC) AA1(_NC) AA11(_CS1_A) AA14(_ODT(ca)_A) AA19(NC) D1(_VSF1) D2(_VSF3) D18(NC) D19(NC) E1(_VSF2) E2(NC) E18(NC) E19(NC) F18(NC) F19(NC) G18(NC) G19(NC)

### Notes on the sheet
- EPOP LPDDR4X+eMMC
- OPEN NOT INTERNALLY CONNECTED
- VREF internally generated
- (near R6) An option that NVCC_ENET can be supplied from SOM board.
- Command/Address
- Ball name    Ball #    LPDDR4      DDR4      DDR3L
  DRAM_AC00    P1        CKE0_A      CKE0      CKE0
  DRAM_AC01    N1        CKE1_A      CKE1      CKE1
  DRAM_AC02    N2        CS0_A       CS0_n     CS0#
  DRAM_AC03    P2        CS1_A       C0         -
  DRAM_AC04    G5        CK_t_A      BG0       BA2
  DRAM_AC05    G4        CK_c_A      BG1       A14
  DRAM_AC06    D4          -         ACT_n     A15
  DRAM_AC07    E4          -         A9        A9
  DRAM_AC08    R1        CA0_A       A12       A12/BC#
  DRAM_AC09    R2        CA1_A       A11       A11
  DRAM_AC10    M2        CA2_A       A7        A7
  DRAM_AC11    L2        CA3_A       A8        A8
  DRAM_AC12    L1        CA4_A       A6        A6
  DRAM_AC13    M1        CA5_A       A5        A5
  DRAM_AC14    Y1          -         A4        A4
  DRAM_AC15    L5          -         A3        A3
  DRAM_AC16    J4          -         CK_t_A    CK_A
  DRAM_AC17    J5          -         CK_c_A    CK#_A
  DRAM_AC20    T1        CKE0_B      CK_t_B    CK_B
  DRAM_AC21    T2        CKE1_B      CK_c_B    CK#_B
  DRAM_AC23    R4        CS0_B         -         -
  DRAM_AC24    Y2        CK_t_B      A2        A2
  DRAM_AC25    AA2       CK_c_B      A1        A1
  DRAM_AC26    W2          -         BA1       BA1
  DRAM_AC28    AA3       CA0_B       A13       A13
  DRAM_AC29    V4        CA1_B       BA0       BA0
  DRAM_AC30    W1        CA2_B       A10/AP    A10/AP
  DRAM_AC31    Y3        CA3_B       A0        A0
  DRAM_AC32    R5        CA4_B       C2        -
  DRAM_AC33    U2        CA5_B       CAS_n/A15 CAS#
  DRAM_AC34    V2            -       WE_n/A14  WE#
  DRAM_AC35    V4            -       RAS_n/A16 RAS#
  DRAM_AC36    V1            -       ODT0      ODT0
- (in symbol LPDDR4 32EP16-M4FTC32-GA68, part A) 32EP16-M4FTC32-GA68 DATA
- (in symbol LPDDR4 32EP16-M4FTC32-GA68, part B) 32EP16-M4FTC32-GA68 PWR
- (in symbol LPDDR4 32EP16-M4FTC32-GA68, part C) 32EP16-M4FTC32-GA68 NC Pins
- (in symbol MIMX8MN, part A) DDR; PAD/(LPDDR4/DDR4/DDR3L)

### Library data of the parts
C1 C4 C6 C10-C12 C14 C16 C18-C20 C22-C29 C31-C43 = CAP_NP: CLASS: DISCRETE
C7 C15 = CAP_NP
CLKm = TESTLOOP: TEST POINT PAD 0.5MM DIA SMT, NO PART TO ORDER; ASSY_OPT: DNP; CLASS: IO; AGILE_PN: 211-77484; CAD_APPROVED: Yes; PCB Footprint: tpad_020; ROHS: Yes; HEIGHT: 0.1MM
CMDm = TESTLOOP: TEST POINT PAD 15MIL DIA SMT, NO PART TO ORDER; ASSY_OPT: DNP; CLASS: IO; CAD_APPROVED: Yes; MFG_PN01: NOTACOMPONENT; AGILE_PN: 211-76645; PCB Footprint: TPAD_015; HEIGHT: 0.1MM; ROHS: Yes; MFG_NAME01: NOTACOMPONENT
DAT0m RSTm TP58 = TESTLOOP: TEST POINT PAD 0.5MM DIA SMT, NO PART TO ORDER; ASSY_OPT: DNP; CLASS: IO; CAD_APPROVED: Yes; AGILE_PN: 211-77484; PCB Footprint: tpad_020; HEIGHT: 0.1MM; ROHS: Yes
DSm = TESTLOOP: TEST POINT PAD 15MIL DIA SMT, NO PART TO ORDER; CLASS: IO; CAD_APPROVED: Yes; MFG_PN01: NOTACOMPONENT; AGILE_PN: 211-76645; PCB Footprint: TPAD_015; HEIGHT: 0.1MM; ROHS: Yes; MFG_NAME01: NOTACOMPONENT
R1 R2 R7 = RES: RES MF 240 OHM 1/20W 1% 0201; CLASS: DISCRETE; Temp Range: -55¡ãC ~ 125¡ãC; VOLTAGE: 25V; PCB Footprint: 0201_CC; FPLIST: CC0201,CC0201_HD,0201_CC; CAD_APPROVED: Yes; MFG_PN01: RC0201FR-07240RL; MFG_NAME01: YAGEO AMERICA; AGILE_PN: 470-81317; HEIGHT: 0.26MM; Temp_Range: -55¡ãC ~ 125¡ãC; ROHS: Yes
R3 R5 = RES: RES MF 10K 1/20W 5% 0201; CLASS: DISCRETE; PCB Footprint: 0201_CC; AGILE_PN: 470-79719; MFG_NAME01: RALEC ELECTRONIC CORP; MFG_PN01: RTT01103JTH; CAD_APPROVED: Yes; FPLIST: RC0201,0201_CC; Tolerance: 5%; ROHS: Yes; HEIGHT: 0.26 MM
R4 = RES: RES MF 10K 1/20W 5% 0201; CLASS: DISCRETE; PCB Footprint: 0201_CC; FPLIST: RC0201,0201_CC; CAD_APPROVED: Yes; MFG_PN01: RTT01103JTH; MFG_NAME01: RALEC ELECTRONIC CORP; AGILE_PN: 470-79719; HEIGHT: 0.26 MM; ROHS: Yes; Tolerance: 5%
R6 = RES: as R216 on sheet Page04 CPU PWR; Tolerance: 5%; ROHS: Yes; HEIGHT: 0.45 MM; VOLTAGE: 1/16W
U1 = MIMX8MN: IC CPU QUAD CORTEX A53+M7 1.4GHZ -- BGA306; PCB Footprint: pbga306_0p5_sq11mm; MFG_NAME01: NXP SEMICONDUCTORS; Temp Range: -40¡ãC to 105¡ãC; PRE_APN: 330-77152; CAD_APPROVED: Yes; AGILE_PN: TMP-CIP-5098; CLASS: IC; MFG_PN01: MIMX8MN5CVPIZAA; ROHS: Yes; HEIGHT: 1.01MM

## Sheet Page06 CPU IO.SchDoc
size 513 x 386 mm; SheetNumber: 4; SheetTotal: 11
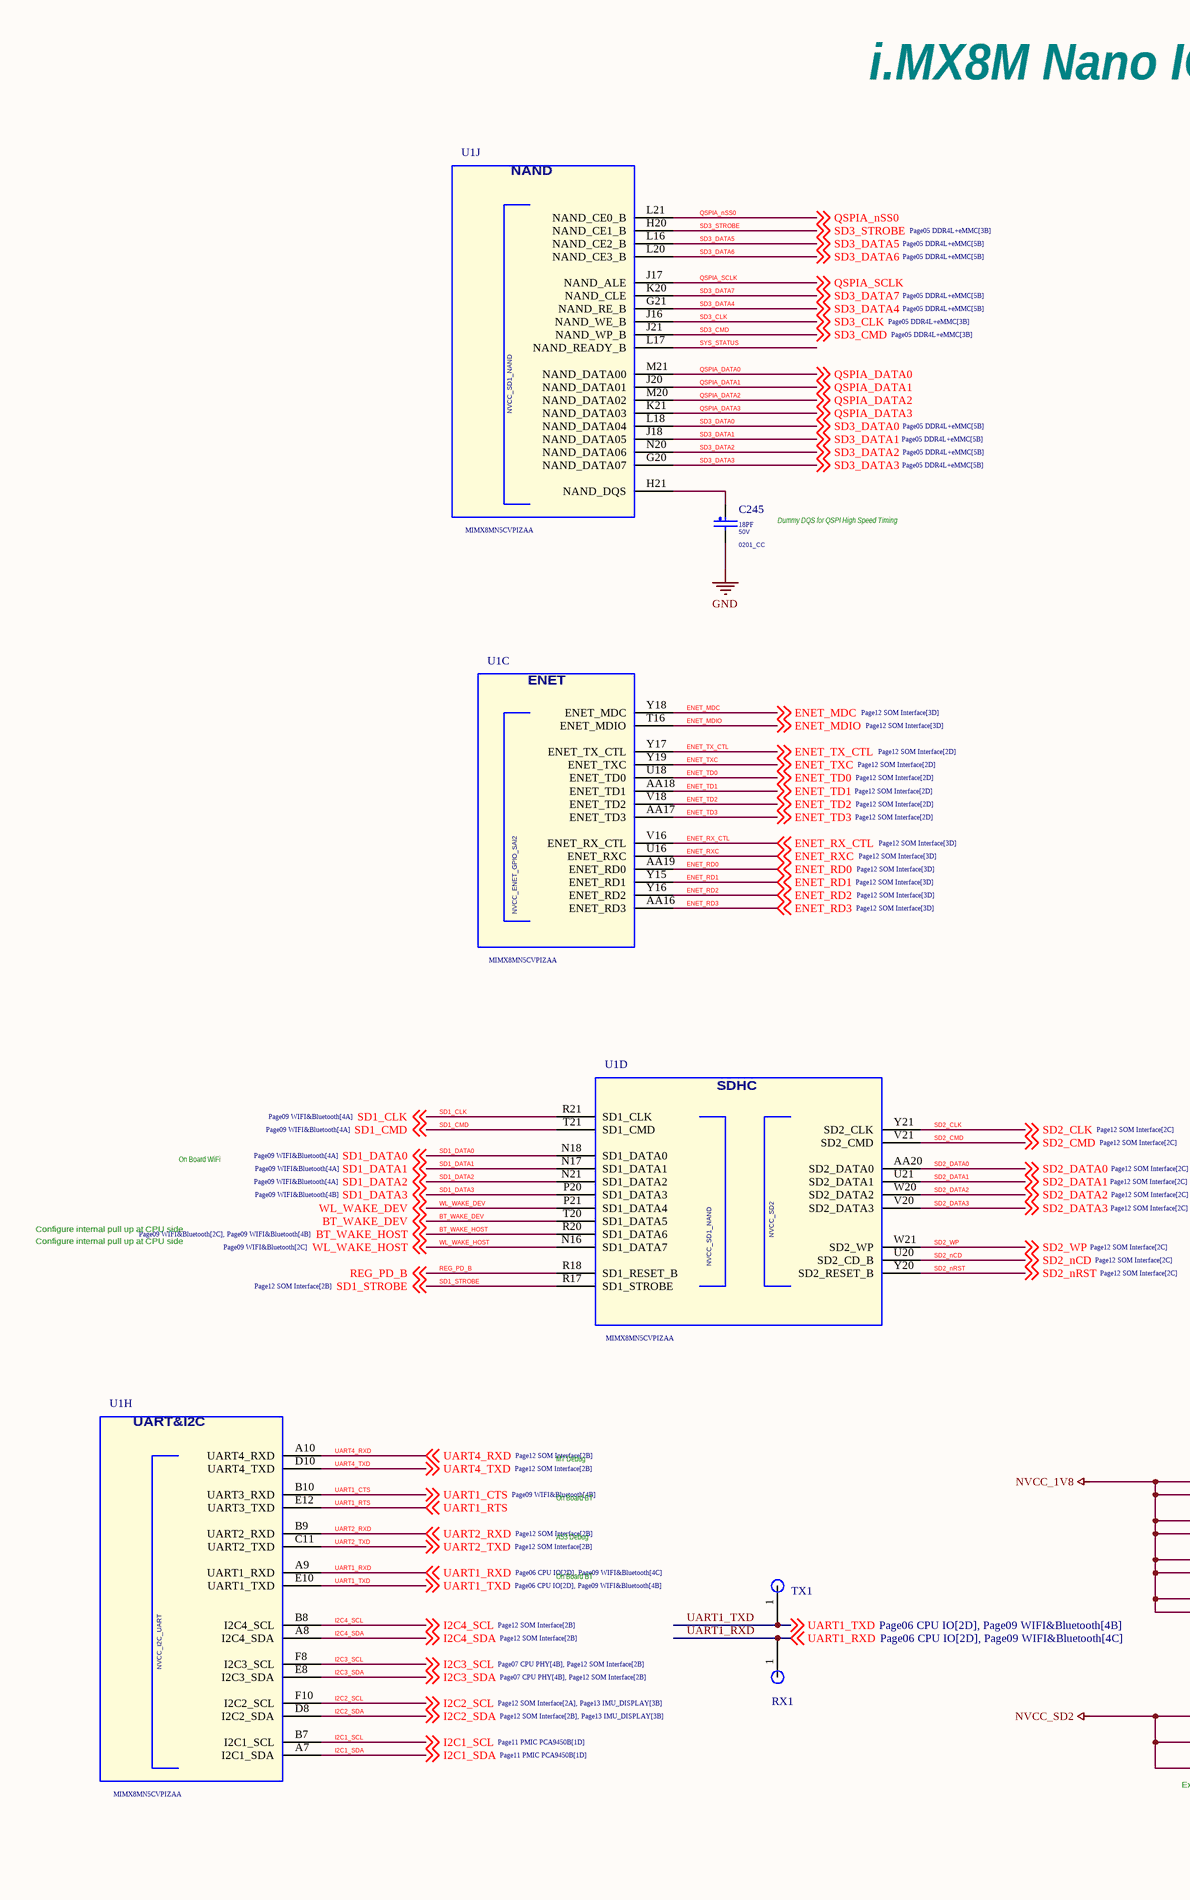
[diagram p3: Page06 CPU IO.SchDoc, left]
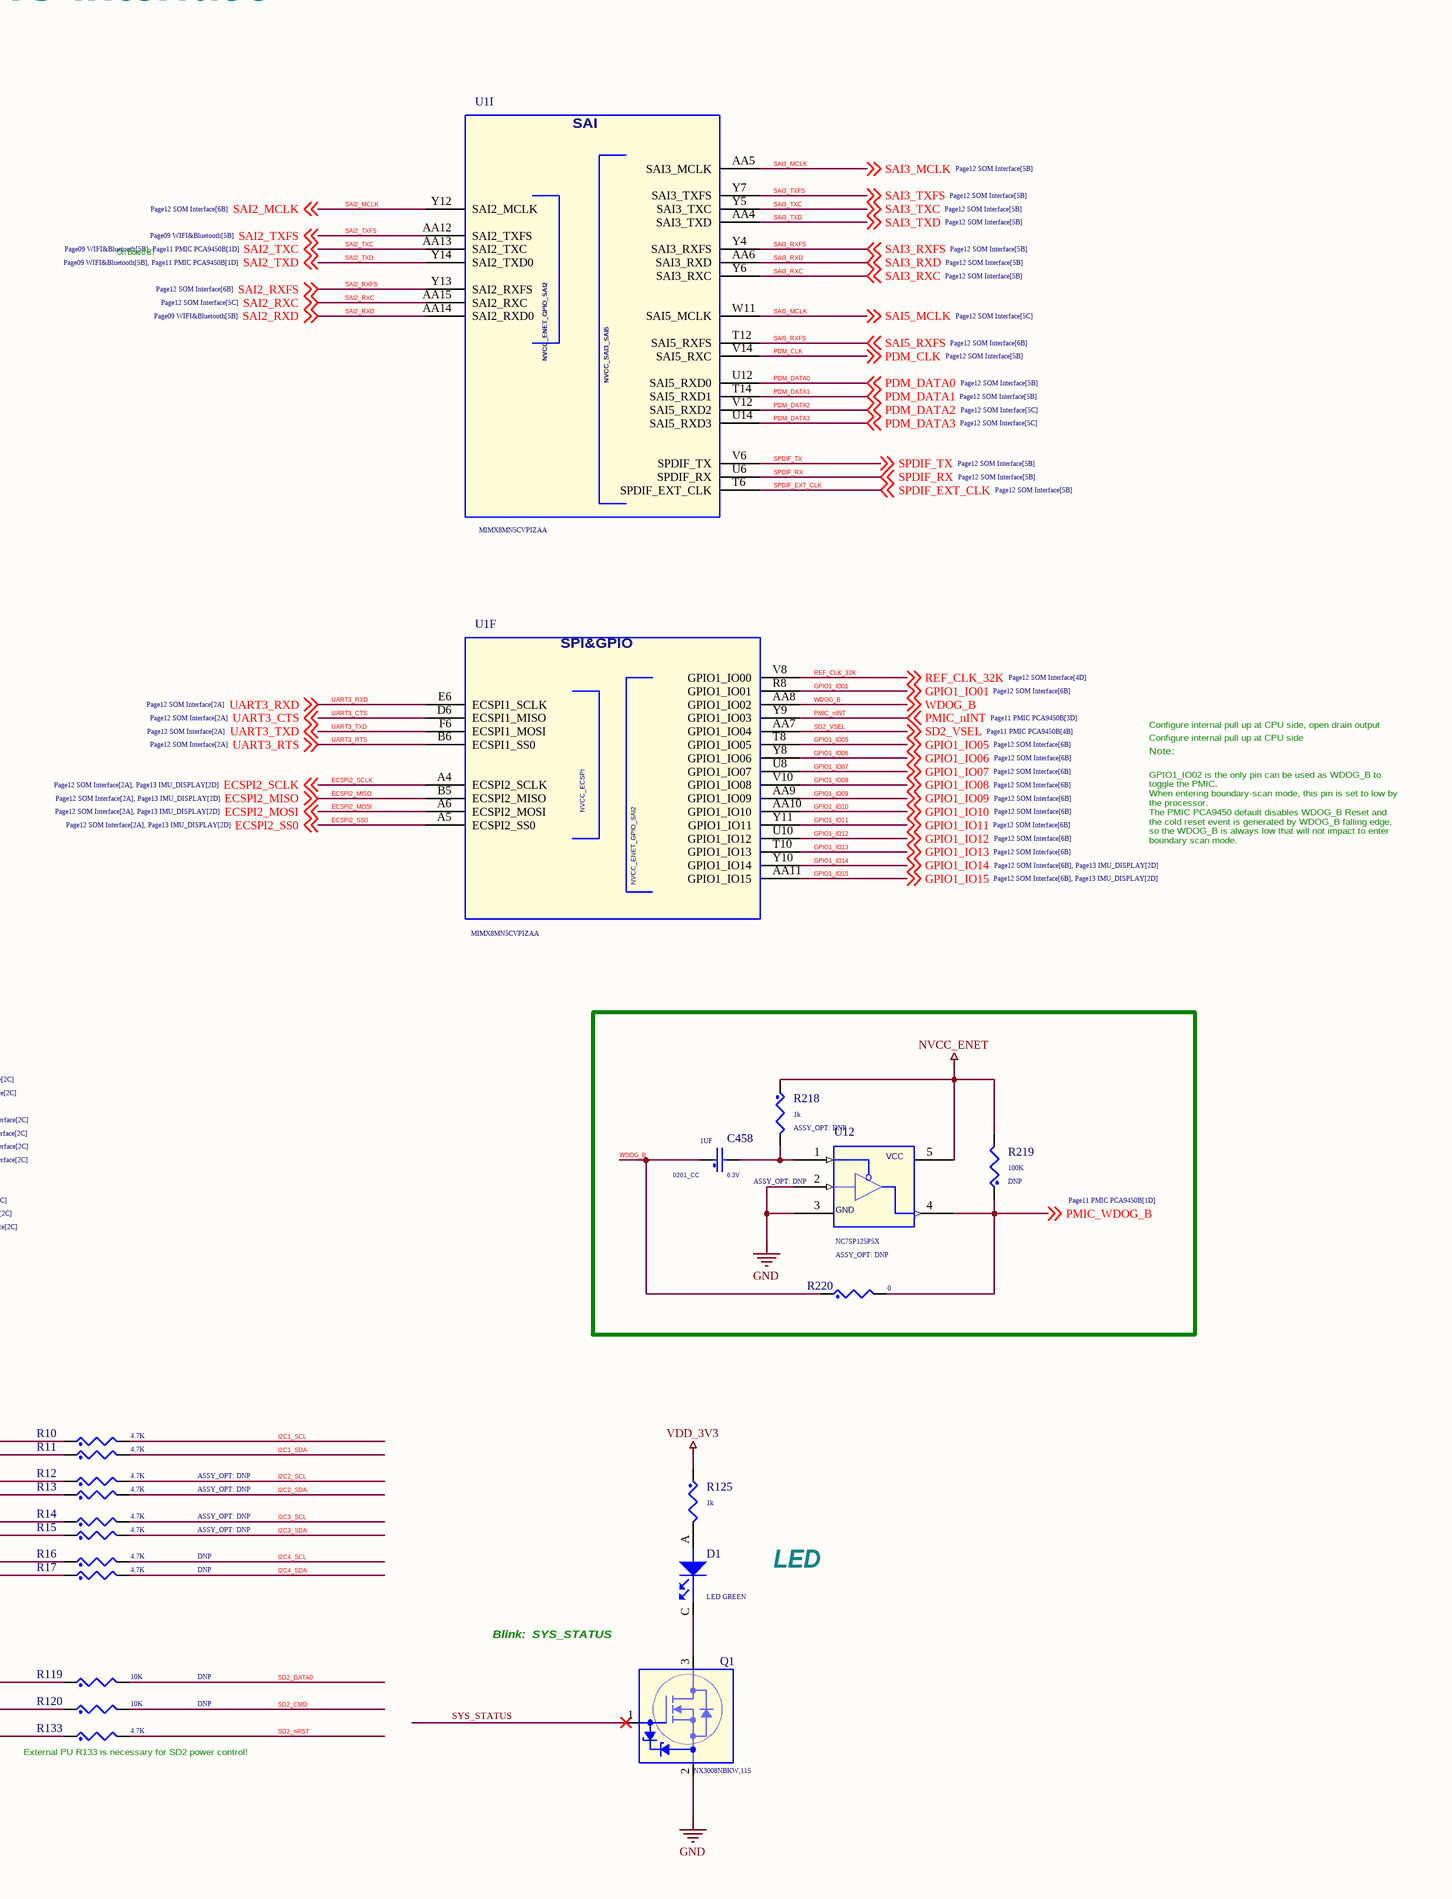
[diagram p4: Page06 CPU IO.SchDoc, right]

### Parts
C245  18PF  VOLTAGE: 50V  PCB Footprint: 0201_CC  [0201_CC - C]
C458  1UF  ASSY_OPT: DNP  PCB Footprint: 0201_CC  VOLTAGE: 6.3V  [0201_CC - C]
D1  LED GREEN  [LED_0603]
Q1  NX3008NBKW,115  [SOT65P210X110-3N]
R10  4.7K  [0201_RES]
R11  4.7K  [0201_RES]
R12  4.7K  ASSY_OPT: DNP  [0201_RES]
R13  4.7K  ASSY_OPT: DNP  [0201_RES]
R14  4.7K  ASSY_OPT: DNP  [0201_RES]
R15  4.7K  ASSY_OPT: DNP  [0201_RES]
R16  4.7K  ASSY_OPT: DNP  [0201_RES]
R17  4.7K  ASSY_OPT: DNP  [0201_RES]
R119  10K  ASSY_OPT: DNP  [0201_RES]
R120  10K  ASSY_OPT: DNP  [0201_RES]
R125  1k  [0201_RES]
R133  4.7K  [0201_RES]
R218  1k  ASSY_OPT: DNP  [0201_RES]
R219  100K  ASSY_OPT: DNP  [0201_RES]
R220  0  [0402_CC_RES]
RX1  Test Pin1  [Test Pin]  (value not drawn)
TX1  Test Pin1  [Test Pin]  (value not drawn)
U1  MIMX8MN5CVPIZAA  [BGA306C50P21X21_1100X1100X101]  (parts C,D,F,H,I,J of 12)
U12  NC7SP125P5X  ASSY_OPT: DNP  [FP-MAA05A-IPC_B]

### Nets
GND: C245.2 Q1.2(SOURCE) U12.2(A) U12.3(GND)
NVCC_1V8: R10.1 R11.1 R12.1 R13.1 R14.1 R15.1 R16.1 R17.1  [project net VDD_1V8]
NVCC_ENET: R218.1 R219.2 U12.5(VCC)
NVCC_SD2: R119.1 R120.1 R133.1
VDD_3V3: R125.1
BT_WAKE_DEV: U1.T20(SD1_DATA5) ; off-sheet BT_WAKE_DEV
BT_WAKE_HOST: U1.R20(SD1_DATA6) ; off-sheet BT_WAKE_HOST
ECSPI2_MISO: U1.B5(ECSPI2_MISO) ; off-sheet ECSPI2_MISO
ECSPI2_MOSI: U1.A6(ECSPI2_MOSI) ; off-sheet ECSPI2_MOSI
ECSPI2_SCLK: U1.A4(ECSPI2_SCLK) ; off-sheet ECSPI2_SCLK
ECSPI2_SS0: U1.A5(ECSPI2_SS0) ; off-sheet ECSPI2_SS0
ENET_MDC: U1.Y18(ENET_MDC) ; off-sheet ENET_MDC
ENET_MDIO: U1.T16(ENET_MDIO) ; off-sheet ENET_MDIO
ENET_RD0: U1.AA19(ENET_RD0) ; off-sheet ENET_RD0
ENET_RD1: U1.Y15(ENET_RD1) ; off-sheet ENET_RD1
ENET_RD2: U1.Y16(ENET_RD2) ; off-sheet ENET_RD2
ENET_RD3: U1.AA16(ENET_RD3) ; off-sheet ENET_RD3
ENET_RX_CTL: U1.V16(ENET_RX_CTL) ; off-sheet ENET_RX_CTL
ENET_RXC: U1.U16(ENET_RXC) ; off-sheet ENET_RXC
ENET_TD0: U1.U18(ENET_TD0) ; off-sheet ENET_TD0
ENET_TD1: U1.AA18(ENET_TD1) ; off-sheet ENET_TD1
ENET_TD2: U1.V18(ENET_TD2) ; off-sheet ENET_TD2
ENET_TD3: U1.AA17(ENET_TD3) ; off-sheet ENET_TD3
ENET_TX_CTL: U1.Y17(ENET_TX_CTL) ; off-sheet ENET_TX_CTL
ENET_TXC: U1.Y19(ENET_TXC) ; off-sheet ENET_TXC
GPIO1_IO01: U1.R8(GPIO1_IO01) ; off-sheet GPIO1_IO01
GPIO1_IO05: U1.T8(GPIO1_IO05) ; off-sheet GPIO1_IO05
GPIO1_IO06: U1.Y8(GPIO1_IO06) ; off-sheet GPIO1_IO06
GPIO1_IO07: U1.U8(GPIO1_IO07) ; off-sheet GPIO1_IO07
GPIO1_IO08: U1.V10(GPIO1_IO08) ; off-sheet GPIO1_IO08
GPIO1_IO09: U1.AA9(GPIO1_IO09) ; off-sheet GPIO1_IO09
GPIO1_IO10: U1.AA10(GPIO1_IO10) ; off-sheet GPIO1_IO10
GPIO1_IO11: U1.Y11(GPIO1_IO11) ; off-sheet GPIO1_IO11
GPIO1_IO12: U1.U10(GPIO1_IO12) ; off-sheet GPIO1_IO12
GPIO1_IO13: U1.T10(GPIO1_IO13) ; off-sheet GPIO1_IO13
GPIO1_IO14: U1.Y10(GPIO1_IO14) ; off-sheet GPIO1_IO14
GPIO1_IO15: U1.AA11(GPIO1_IO15) ; off-sheet GPIO1_IO15
I2C1_SCL: R10.2 U1.B7(I2C1_SCL) ; off-sheet I2C1_SCL
I2C1_SDA: R11.2 U1.A7(I2C1_SDA) ; off-sheet I2C1_SDA
I2C2_SCL: R12.2 U1.F10(I2C2_SCL) ; off-sheet I2C2_SCL
I2C2_SDA: R13.2 U1.D8(I2C2_SDA) ; off-sheet I2C2_SDA
I2C3_SCL: R14.2 U1.F8(I2C3_SCL) ; off-sheet I2C3_SCL
I2C3_SDA: R15.2 U1.E8(I2C3_SDA) ; off-sheet I2C3_SDA
I2C4_SCL: R16.2 U1.B8(I2C4_SCL) ; off-sheet I2C4_SCL
I2C4_SDA: R17.2 U1.A8(I2C4_SDA) ; off-sheet I2C4_SDA
PDM_CLK: U1.V14(SAI5_RXC) ; off-sheet PDM_CLK
PDM_DATA0: U1.U12(SAI5_RXD0) ; off-sheet PDM_DATA0
PDM_DATA1: U1.T14(SAI5_RXD1) ; off-sheet PDM_DATA1
PDM_DATA2: U1.V12(SAI5_RXD2) ; off-sheet PDM_DATA2
PDM_DATA3: U1.U14(SAI5_RXD3) ; off-sheet PDM_DATA3
PMIC_nINT: U1.Y9(GPIO1_IO03) ; off-sheet PMIC_nINT
PMIC_WDOG_B: R219.1 R220.2 U12.4(Y) ; off-sheet PMIC_WDOG_B
QSPIA_DATA0: U1.M21(NAND_DATA00) ; off-sheet QSPIA_DATA0
QSPIA_DATA1: U1.J20(NAND_DATA01) ; off-sheet QSPIA_DATA1
QSPIA_DATA2: U1.M20(NAND_DATA02) ; off-sheet QSPIA_DATA2
QSPIA_DATA3: U1.K21(NAND_DATA03) ; off-sheet QSPIA_DATA3
QSPIA_nSS0: U1.L21(NAND_CE0_B) ; off-sheet QSPIA_nSS0
QSPIA_SCLK: U1.J17(NAND_ALE) ; off-sheet QSPIA_SCLK
REF_CLK_32K: U1.V8(GPIO1_IO00) ; off-sheet REF_CLK_32K
REG_PD_B: U1.R18(SD1_RESET_B) ; off-sheet REG_PD_B
SAI2_MCLK: U1.Y12(SAI2_MCLK) ; off-sheet SAI2_MCLK
SAI2_RXC: U1.AA15(SAI2_RXC) ; off-sheet SAI2_RXC
SAI2_RXD: U1.AA14(SAI2_RXD0) ; off-sheet SAI2_RXD
SAI2_RXFS: U1.Y13(SAI2_RXFS) ; off-sheet SAI2_RXFS
SAI2_TXC: U1.AA13(SAI2_TXC) ; off-sheet SAI2_TXC
SAI2_TXD: U1.Y14(SAI2_TXD0) ; off-sheet SAI2_TXD
SAI2_TXFS: U1.AA12(SAI2_TXFS) ; off-sheet SAI2_TXFS
SAI3_MCLK: U1.AA5(SAI3_MCLK) ; off-sheet SAI3_MCLK
SAI3_RXC: U1.Y6(SAI3_RXC) ; off-sheet SAI3_RXC
SAI3_RXD: U1.AA6(SAI3_RXD) ; off-sheet SAI3_RXD
SAI3_RXFS: U1.Y4(SAI3_RXFS) ; off-sheet SAI3_RXFS
SAI3_TXC: U1.Y5(SAI3_TXC) ; off-sheet SAI3_TXC
SAI3_TXD: U1.AA4(SAI3_TXD) ; off-sheet SAI3_TXD
SAI3_TXFS: U1.Y7(SAI3_TXFS) ; off-sheet SAI3_TXFS
SAI5_MCLK: U1.W11(SAI5_MCLK) ; off-sheet SAI5_MCLK
SAI5_RXFS: U1.T12(SAI5_RXFS) ; off-sheet SAI5_RXFS
SD1_CLK: U1.R21(SD1_CLK) ; off-sheet SD1_CLK
SD1_CMD: U1.T21(SD1_CMD) ; off-sheet SD1_CMD
SD1_DATA0: U1.N18(SD1_DATA0) ; off-sheet SD1_DATA0
SD1_DATA1: U1.N17(SD1_DATA1) ; off-sheet SD1_DATA1
SD1_DATA2: U1.N21(SD1_DATA2) ; off-sheet SD1_DATA2
SD1_DATA3: U1.P20(SD1_DATA3) ; off-sheet SD1_DATA3
SD1_STROBE: U1.R17(SD1_STROBE) ; off-sheet SD1_STROBE
SD2_CLK: U1.Y21(SD2_CLK) ; off-sheet SD2_CLK
SD2_CMD: R120.2 U1.V21(SD2_CMD) ; off-sheet SD2_CMD
SD2_DATA0: R119.2 U1.AA20(SD2_DATA0) ; off-sheet SD2_DATA0
SD2_DATA1: U1.U21(SD2_DATA1) ; off-sheet SD2_DATA1
SD2_DATA2: U1.W20(SD2_DATA2) ; off-sheet SD2_DATA2
SD2_DATA3: U1.V20(SD2_DATA3) ; off-sheet SD2_DATA3
SD2_nCD: U1.U20(SD2_CD_B) ; off-sheet SD2_nCD
SD2_nRST: R133.2 U1.Y20(SD2_RESET_B) ; off-sheet SD2_nRST
SD2_VSEL: U1.AA7(GPIO1_IO04) ; off-sheet SD2_VSEL
SD2_WP: U1.W21(SD2_WP) ; off-sheet SD2_WP
SD3_CLK: U1.J16(NAND_WE_B) ; off-sheet SD3_CLK
SD3_CMD: U1.J21(NAND_WP_B) ; off-sheet SD3_CMD
SD3_DATA0: U1.L18(NAND_DATA04) ; off-sheet SD3_DATA0
SD3_DATA1: U1.J18(NAND_DATA05) ; off-sheet SD3_DATA1
SD3_DATA2: U1.N20(NAND_DATA06) ; off-sheet SD3_DATA2
SD3_DATA3: U1.G20(NAND_DATA07) ; off-sheet SD3_DATA3
SD3_DATA4: U1.G21(NAND_RE_B) ; off-sheet SD3_DATA4
SD3_DATA5: U1.L16(NAND_CE2_B) ; off-sheet SD3_DATA5
SD3_DATA6: U1.L20(NAND_CE3_B) ; off-sheet SD3_DATA6
SD3_DATA7: U1.K20(NAND_CLE) ; off-sheet SD3_DATA7
SD3_STROBE: U1.H20(NAND_CE1_B) ; off-sheet SD3_STROBE
SPDIF_EXT_CLK: U1.T6(SPDIF_EXT_CLK) ; off-sheet SPDIF_EXT_CLK
SPDIF_RX: U1.U6(SPDIF_RX) ; off-sheet SPDIF_RX
SPDIF_TX: U1.V6(SPDIF_TX) ; off-sheet SPDIF_TX
SYS_STATUS: Q1.1(GATE) U1.L17(NAND_READY_B)
UART1_CTS: U1.B10(UART3_RXD) ; off-sheet UART1_CTS  [project net BT_CTS]
UART1_RTS: U1.E12(UART3_TXD) ; off-sheet UART1_RTS
UART1_RXD: RX1.1 U1.A9(UART1_RXD) ; off-sheet UART1_RXD  [project net BT_TXD]
UART1_TXD: TX1.1 U1.E10(UART1_TXD) ; off-sheet UART1_TXD  [project net BT_RXD]
UART2_RXD: U1.B9(UART2_RXD) ; off-sheet UART2_RXD
UART2_TXD: U1.C11(UART2_TXD) ; off-sheet UART2_TXD
UART3_CTS: U1.D6(ECSPI1_MISO) ; off-sheet UART3_CTS
UART3_RTS: U1.B6(ECSPI1_SS0) ; off-sheet UART3_RTS
UART3_RXD: U1.E6(ECSPI1_SCLK) ; off-sheet UART3_RXD
UART3_TXD: U1.F6(ECSPI1_MOSI) ; off-sheet UART3_TXD
UART4_RXD: U1.A10(UART4_RXD) ; off-sheet UART4_RXD
UART4_TXD: U1.D10(UART4_TXD) ; off-sheet UART4_TXD
WDOG_B: C458.1 R220.1 U1.AA8(GPIO1_IO02) ; off-sheet WDOG_B
WL_WAKE_DEV: U1.P21(SD1_DATA4) ; off-sheet WL_WAKE_DEV
WL_WAKE_HOST: U1.N16(SD1_DATA7) ; off-sheet WL_WAKE_HOST
NetC245_1: C245.1 U1.H21(NAND_DQS)
NetC458_2: C458.2 R218.2 U12.1(~{OE})
NetD1_A: D1.A(ANODE) R125.2
NetD1_C: D1.C(CATHODE) Q1.3(DRAIN)

### Notes on the sheet
- i.MX8M Nano IO Interface
- On Board BT
- Dummy DQS for QSPI High Speed Timing
- Configure internal pull up at CPU side, open drain output
- Configure internal pull up at CPU side
- Note:
- GPIO1_IO02 is the only pin can be used as WDOG_B to
  toggle the PMIC.
  When entering boundary-scan mode, this pin is set to low by
  the processor.
  The PMIC PCA9450 default disables WDOG_B Reset and
  the cold reset event is generated by WDOG_B falling edge,
  so the WDOG_B is always low that will not impact to enter
  boundary scan mode.
- On Board WiFi
- M7 Debug
- A53 Debug
- LED
- Blink:  SYS_STATUS
- (near R133) External PU R133 is necessary for SD2 power control!
- (in symbol MIMX8MN, part C) ENET
- (in symbol MIMX8MN, part D) SDHC
- (in symbol MIMX8MN, part F) SPI&GPIO
- (in symbol MIMX8MN, part H) UART&I2C
- (in symbol MIMX8MN, part I) SAI
- (in symbol MIMX8MN, part J) NAND

### Library data of the parts
C245 = CAP_NP: CAP CER 18pF 50V 5% C0G 0201; CLASS: DISCRETE; FPLIST: CC0201,CC0201_HD,0201_CC; CAD_APPROVED: Yes; MFG_PN01: GRM0335C1H180JA01D; MFG_NAME01: MURATA; AGILE_PN: 150-79476; Package Type: &#966;180mm Paper taping; Package Size: 0201; HEIGHT: 0.33MM; ROHS: Yes; Tolerance: 5%
C458 = CAP_NP: as C93 on sheet Page04 CPU PWR; Tolerance: 20%; ROHS: Yes; HEIGHT: 0.35MM; Package Size: 0201; Package Type: 7¡± reel
D1 = LED: LED GRN SGL 25MA SMT 0603; CLASS: IC; VOLTAGE: 2V; AGILE_PN: 370-76672; MFG_NAME01: DIALIGHT; MFG_PN01: 598-8070-107F; CAD_APPROVED: Yes; ROHS: Yes; HEIGHT: 0.8 MM; PCB Footprint: LED_0603
Q1 = NMOS_NX3008NBK: TRAN NMOS SW 30V 350mA AEC-Q101 SC-70; CLASS: IC; CAD_APPROVED: Yes; MFG_NAME01: NEXPERIA; AGILE_PN: 480-79736; PCB Footprint: sc70_3; HEIGHT: 1.1MM; ROHS: Yes; MFG_PN01: NX3008NBKW,115
R10 R11 R14-R17 R133 = RES: RES MF 4.7K 1/20W 5% AEC-Q200 0201; CLASS: DISCRETE; Temp Range: -55C to +155C; AGILE_PN: 470-79700; MFG_NAME01: KOA SPEER; MFG_PN01: RK73B1HTTC472J; CAD_APPROVED: Yes; FPLIST: RC0201,0201_CC; PCB Footprint: 0201_CC; Tolerance: 5%; ROHS: Yes; Temp_Range: -55C to +155C; HEIGHT: 0.25MM
R12 R13 = RES: RES MF 4.7K 1/20W 5% AEC-Q200 0201; CLASS: DISCRETE; Temp Range: -55C to +155C; FPLIST: RC0201,0201_CC; CAD_APPROVED: Yes; MFG_PN01: RK73B1HTTC472J; MFG_NAME01: KOA SPEER; AGILE_PN: 470-79700; PCB Footprint: 0201_CC; HEIGHT: 0.25MM; Temp_Range: -55C to +155C; ROHS: Yes; Tolerance: 5%
R119 = RES: RES MF 10K 1/20W 5% 0201; CLASS: DISCRETE; FPLIST: RC0201,0201_CC; CAD_APPROVED: Yes; MFG_PN01: RTT01103JTH; MFG_NAME01: RALEC ELECTRONIC CORP; AGILE_PN: 470-79719; PCB Footprint: 0201_CC; HEIGHT: 0.26 MM; ROHS: Yes; Tolerance: 5%
R120 = RES: RES MF 10K 1/20W 5% 0201; CLASS: DISCRETE; AGILE_PN: 470-79719; MFG_NAME01: RALEC ELECTRONIC CORP; MFG_PN01: RTT01103JTH; CAD_APPROVED: Yes; FPLIST: RC0201,0201_CC; PCB Footprint: 0201_CC; Tolerance: 5%; ROHS: Yes; HEIGHT: 0.26 MM
R125 = RES: RES MF 1.0K OHM 1/20W 1% 30V -55+155C 0201; CLASS: DISCRETE; Temp Range: -55¡ãC ~ 155¡ãC; VOLTAGE: 30; FPLIST: RC0201,0201_CC; CAD_APPROVED: Yes; MFG_PN01: CRCW02011K00FNED; MFG_NAME01: VISHAY INTERTECHNOLOGY; AGILE_PN: 470-82221; PCB Footprint: 0201_CC; HEIGHT: 0.28MM; Temp_Range: -55¡ãC ~ 155¡ãC; ROHS: Yes; Tolerance: 1%
R218 = RES: RES MF 1.0K OHM 1/20W 1% 30V -55+155C 0201; CLASS: DISCRETE; PCB Footprint: 0201_CC; AGILE_PN: 470-82221; MFG_NAME01: VISHAY INTERTECHNOLOGY; MFG_PN01: CRCW02011K00FNED; Temp_Range: -55¡ãC ~ 155¡ãC; CAD_APPROVED: Yes; FPLIST: RC0201,0201_CC; VOLTAGE: 30; Tolerance: 1%; ROHS: Yes; HEIGHT: 0.28MM; Temp Range: -55¡ãC ~ 155¡ãC
R219 = RES: RES MF 100K 1/20W 1% 0201; CLASS: DISCRETE; PCB Footprint: 0201_CC; AGILE_PN: 470-77704; MFG_NAME01: SKYMOS; MFG_PN01: RC-0201-104FT; CAD_APPROVED: Yes; FPLIST: RC0201,0201_CC; Tolerance: 1%; ROHS: Yes; HEIGHT: 0.26MM
R220 = RES: RES MF ZERO OHM 1/16W 5% 0402; CLASS: DISCRETE; PCB Footprint: 0402_CC; FPLIST: RC0402_25,RC0402_HD,RC0402_X2,0402_CC; CAD_APPROVED: Yes; MFG_PN01: RC0402JR-070RL; MFG_NAME01: YAGEO AMERICA; AGILE_PN: 470-75394; HEIGHT: 0.45 MM; ROHS: Yes; Tolerance: 5%; VOLTAGE: 1/16W
U1 = MIMX8MN: as U1 on sheet Page04 CPU PWR; CLASS: IC; HEIGHT: 1.01MM; ROHS: Yes; MFG_PN01: MIMX8MN5CVPIZAA
U12 = 1G125: IC BUF TS 0.9-3.6V; PCB Footprint: SC70-5_A; MFG_NAME01: FAIRCHILD; CAD_APPROVED: Yes; AGILE_PN: 312-30153; CLASS: IC; MFG_PN01: NC7SP125P5X; ROHS: Yes; HEIGHT: 1.1MM

## Sheet Page07 CPU PHY.SchDoc
size 386 x 246 mm; SheetNumber: 5; SheetTotal: 11
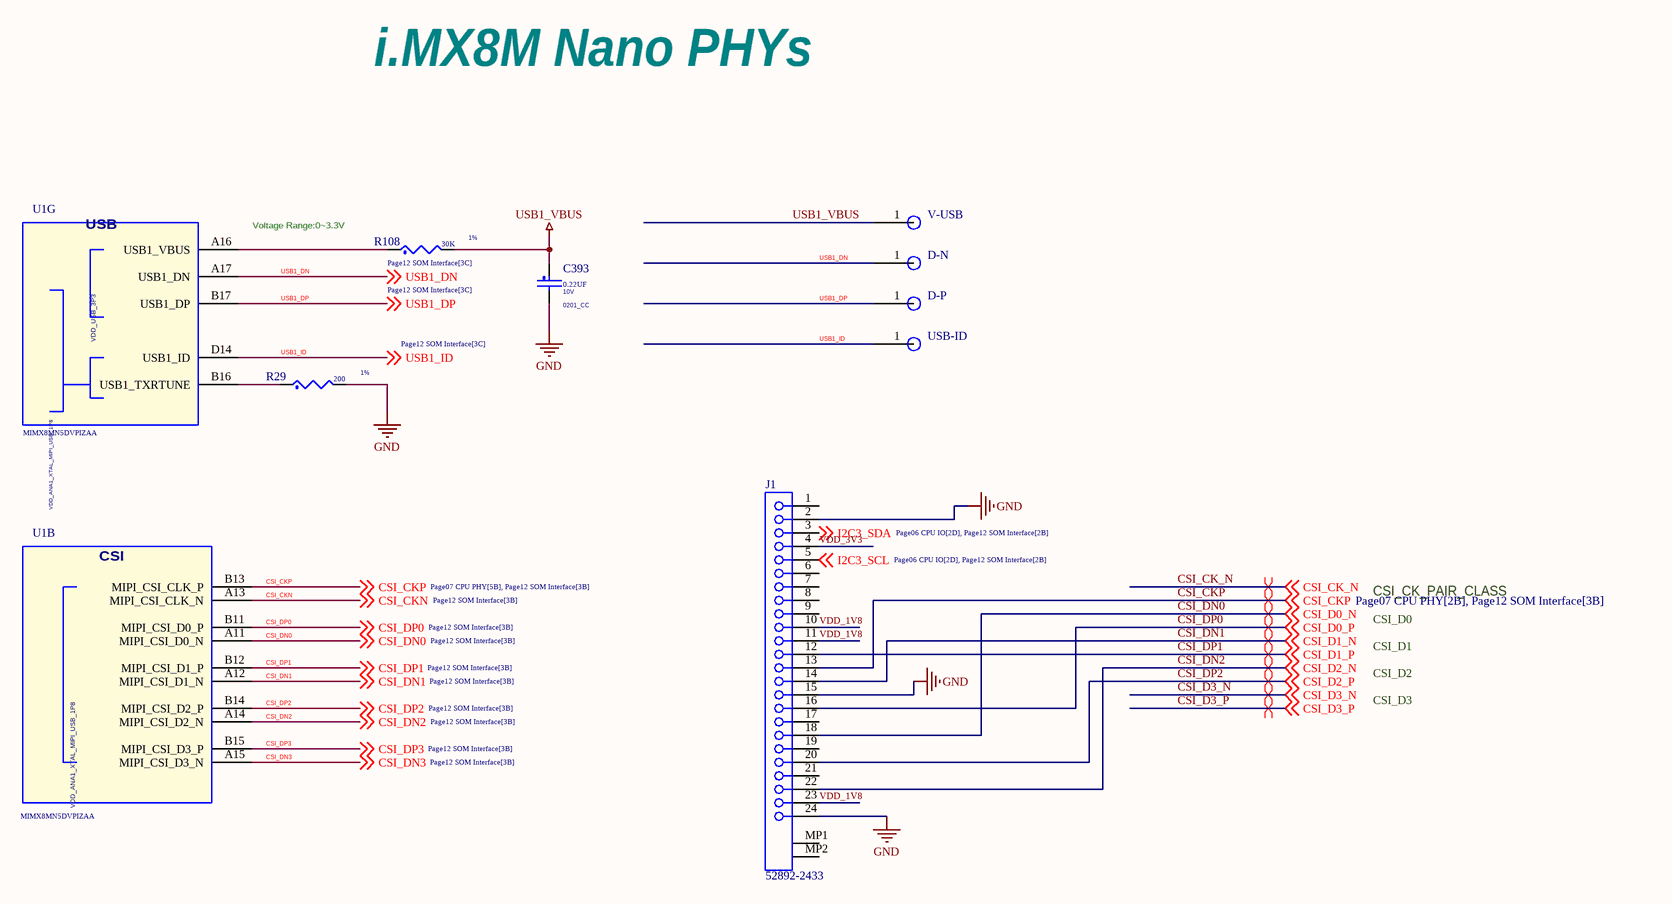
[diagram p5: Page07 CPU PHY.SchDoc]

### Parts
C393  0.22UF  VOLTAGE: 10V  PCB Footprint: 0201_CC  [0201_CC - C]
D-N  Test Pin1  [Test Pin]  (value not drawn)
D-P  Test Pin1  [Test Pin]  (value not drawn)
J1  52892-2433  [MOLX-52892-2433]
R29  200  Tolerance: 1%  [0201_RES]
R108  30K  Tolerance: 1%  [0201_RES]
U1  MIMX8MN5DVPIZAA  [BGA306C50P21X21_1100X1100X101]  (parts B,G of 12)
USB-ID  Test Pin1  [Test Pin]  (value not drawn)
V-USB  Test Pin1  [Test Pin]  (value not drawn)

### Nets
GND: C393.2 J1.2 J1.15 J1.24 R29.2
USB1_VBUS: C393.1 R108.2 V-USB.1
VDD_1V8: J1.10 J1.11 J1.23
VDD_3V3: J1.4
CSI_CKN: U1.A13(MIPI_CSI_CLK_N) ; off-sheet CSI_CKN
CSI_CKP: J1.13 U1.B13(MIPI_CSI_CLK_P) ; off-sheet CSI_CKP
CSI_DN0: J1.18 U1.A11(MIPI_CSI_D0_N) ; off-sheet CSI_DN0, off-sheet CSI_D0_N  [also labelled CSI_D0_N]
CSI_DN1: J1.14 U1.A12(MIPI_CSI_D1_N) ; off-sheet CSI_DN1, off-sheet CSI_D1_N  [also labelled CSI_D1_N]
CSI_DN2: J1.22 U1.A14(MIPI_CSI_D2_N) ; off-sheet CSI_DN2, off-sheet CSI_D2_N  [also labelled CSI_D2_N]
CSI_DN3: U1.A15(MIPI_CSI_D3_N) ; off-sheet CSI_DN3
CSI_DP0: J1.16 U1.B11(MIPI_CSI_D0_P) ; off-sheet CSI_DP0, off-sheet CSI_D0_P  [also labelled CSI_D0_P]
CSI_DP1: J1.12 U1.B12(MIPI_CSI_D1_P) ; off-sheet CSI_DP1, off-sheet CSI_D1_P  [also labelled CSI_D1_P]
CSI_DP2: J1.20 U1.B14(MIPI_CSI_D2_P) ; off-sheet CSI_DP2, off-sheet CSI_D2_P  [also labelled CSI_D2_P]
CSI_DP3: U1.B15(MIPI_CSI_D3_P) ; off-sheet CSI_DP3
I2C3_SCL: J1.5 ; off-sheet I2C3_SCL
I2C3_SDA: J1.3 ; off-sheet I2C3_SDA
USB1_DN: D-N.1 U1.A17(USB1_DN) ; off-sheet USB1_DN
USB1_DP: D-P.1 U1.B17(USB1_DP) ; off-sheet USB1_DP
USB1_ID: U1.D14(USB1_ID) USB-ID.1 ; off-sheet USB1_ID
NetR29_1: R29.1 U1.B16(USB1_TXRTUNE)
NetR108_1: R108.1 U1.A16(USB1_VBUS)

Not connected (* = marked no-connect by the designer): J1 1 6 7 8 9 17 19 21 MP1 MP2

### Layout directives
differential pair; differential pair class CSI_CK_PAIR_CLASS: CSI_CK_N
differential pair: CSI_CKP, CSI_D3_P, CSI_DP0, CSI_DP1, CSI_DP2
differential pair; differential pair class CSI_D0: CSI_DN0
differential pair; differential pair class CSI_D1: CSI_DN1
differential pair; differential pair class CSI_D2: CSI_DN2
differential pair; differential pair class CSI_D3: CSI_D3_N

### Notes on the sheet
- i.MX8M Nano PHYs
- Voltage Range:0~3.3V
- (in symbol MIMX8MN, part B) CSI
- (in symbol MIMX8MN, part G) USB

### Library data of the parts
C393 = CAP_NP: as C3 on sheet Page04 CPU PWR; HEIGHT: 0.33MM; ROHS: Yes; Tolerance: 20%
J1 = CMP-1241-00475-1: 0.5 mm Pitch Easy-On(TM) Type FPC Connector, 2.0 mm Mated Height, Right Angle, ZIF, SMT, Bottom Contact, 24 Circuits, -40 to 85 degC, ELV and RoHS Compliant, Tape and Reel; Manufacturer: Molex; Entry Angle: 90degrees Angle; Current (Max per Contact): 0.5A; Material - Plating Termination: Silver, Tin-Bismuth; Stackable: No; Durability (mating cycles max): 20; Pitch - Termination Interface: 0.50mm; Material - Metal: Phosphor Bronze; PCB Retention: Yes; Voltage (Max): 50V; Mated Height: 2.00mm; Circuits (Loaded): 24; Orientation: Right Angle; PackageVersion: Rev. A, 05/2013; Mounting Technology: Surface Mount; ComponentLink2URL: http://www.molex.com/webdocs/datasheets/pdf/en-us/0528922433_FFC_FPC_CONNECTORS.pdf; RoHS: TRUE; ComponentLink1Description: Manufacturer URL; ComponentLink2Description: Datasheet; Pitch - Mating Interface: 0.50mm; Polarized to PCB: No; Number of Rows: 1; PartNumber: 52892-2433; ComponentLink3Description: Package Specification; Material - Plating Mating: Silver, Tin-Bismuth; ComponentLink3URL: http://www.molex.com/pdm_docs/sd/528922433_sd.pdf; PackageReference: 52892-2433; PackageDescription: 24-Lead FPC Connector, Pitch 0.5 mm; Contact Position: Bottom; ComponentLink1URL: http://www.molex.com/molex/index.jsp; Packing: Tape and Reel; PCB Locator: No
R29 = RES: RES MF 200 OHM 1/20W 1% 0201; CLASS: DISCRETE; PCB Footprint: 0201_CC; FPLIST: RC0201,0201_CC; CAD_APPROVED: Yes; Temp_Range: -55¡ãC ~ 125¡ãC; MFG_PN01: RC0201FR-07200RL; MFG_NAME01: YAGEO AMERICA; AGILE_PN: 470-82323; VOLTAGE: 25V; HEIGHT: 0.26MM; ROHS: Yes; Temp Range: -55¡ãC ~ 125¡ãC
R108 = RES: RES MF 30K 1/20W 1% 0201; CLASS: DISCRETE; Temp Range: -55¡ãC ~ 155¡ãC; VOLTAGE: 25V; PCB Footprint: 0201_CC; AGILE_PN: 470-81353; MFG_NAME01: YAGEO AMERICA; MFG_PN01: RC0201FR-0730KL; CAD_APPROVED: Yes; FPLIST: RC0201,0201_CC; ROHS: Yes; Temp_Range: -55¡ãC ~ 155¡ãC; HEIGHT: 0.26MM
U1 = MIMX8MN: IC CPU QUAD CORTEX A53+M7 1.4GHZ -- BGA306; PCB Footprint: pbga306_0p5_sq11mm; AGILE_PN: TMP-CIP-5098; CAD_APPROVED: Yes; PRE_APN: 330-77152; Temp Range: -40¡ãC to 105¡ãC; MFG_NAME01: NXP SEMICONDUCTORS; MFG_PN01: MIMX8MN5CVPIZAA; CLASS: IC; HEIGHT: 1.01MM; ROHS: Yes

## Sheet Page08 CPU MISC.SchDoc
size 350 x 209 mm; SheetNumber: 6; SheetTotal: 11
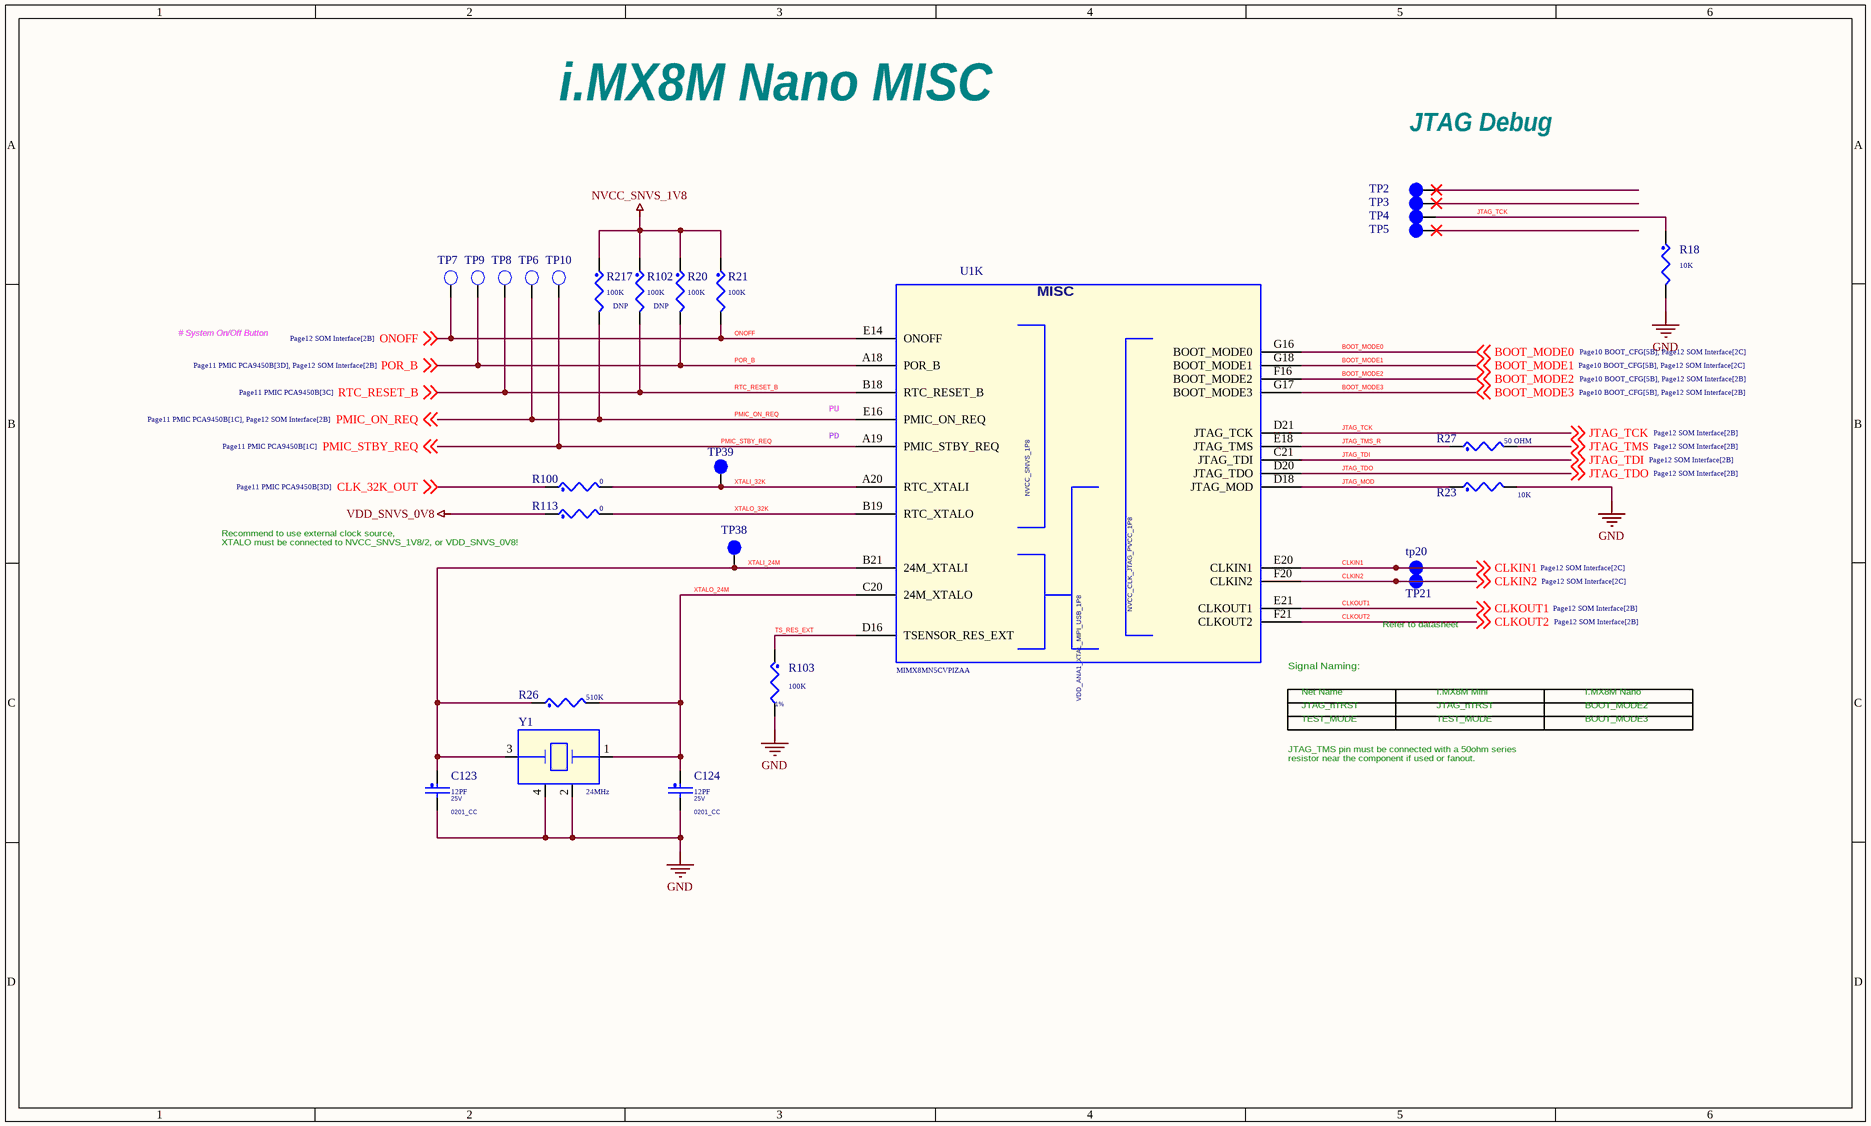
[diagram p6: Page08 CPU MISC.SchDoc]

### Parts
C123  12PF  VOLTAGE: 25V  PCB Footprint: 0201_CC  [0201_CC - C]
C124  12PF  VOLTAGE: 25V  PCB Footprint: 0201_CC  [0201_CC - C]
R18  10K  [0201_RES]
R20  100K  [0201_RES]
R21  100K  [0201_RES]
R23  10K  [0201_RES]
R26  510K  [0402_CC_RES]
R27  50 OHM  [0402_CC_RES]
R100  0  [0402_CC_RES]
R102  100K  ASSY_OPT: DNP  [0201_RES]
R103  100K  Tolerance: 1%  [0201_RES]
R113  0  [0402_CC_RES]
R217  100K  ASSY_OPT: DNP  [0201_RES]
TP2  tpad_020  [Test Pin]  (value not drawn)  (graphical)
TP3  tpad_020  [Test Pin]  (value not drawn)  (graphical)
TP4  tpad_020  [Test Pin]  (value not drawn)  (graphical)
TP5  tpad_020  [Test Pin]  (value not drawn)  (graphical)
TP6  TP_35MIL  [Test Pin]  (value not drawn)
TP7  TP_35MIL  [Test Pin]  (value not drawn)
TP8  TP_35MIL  [Test Pin]  (value not drawn)
TP9  TP_35MIL  [Test Pin]  (value not drawn)
TP10  TP_35MIL  [Test Pin]  (value not drawn)
tp20  tpad_020  [Test Pin]  (value not drawn)  (graphical)
TP21  tpad_020  [Test Pin]  (value not drawn)  (graphical)
TP38  tpad_020  [Test Pin]  (value not drawn)  (graphical)
TP39  tpad_020  [Test Pin]  (value not drawn)  (graphical)
U1  MIMX8MN5CVPIZAA  [BGA306C50P21X21_1100X1100X101]  (part K of 12)
Y1  24MHz  [OSCCC320X250X60]

### Nets
GND: C123.2 C124.2 R18.2 R23.2 R103.2 Y1.2 Y1.4
NVCC_SNVS_1V8: R20.1 R21.1 R102.1 R217.1
VDD_SNVS_0V8: R113.1
BOOT_MODE0: U1.G16(BOOT_MODE0) ; off-sheet BOOT_MODE0
BOOT_MODE1: U1.G18(BOOT_MODE1) ; off-sheet BOOT_MODE1
BOOT_MODE2: U1.F16(BOOT_MODE2) ; off-sheet BOOT_MODE2
BOOT_MODE3: U1.G17(BOOT_MODE3) ; off-sheet BOOT_MODE3
CLK_32K_OUT: R100.1 ; off-sheet CLK_32K_OUT
CLKIN1: tp20.1(Pin1) U1.E20(CLKIN1) ; off-sheet CLKIN1
CLKIN2: TP21.1(Pin1) U1.F20(CLKIN2) ; off-sheet CLKIN2
CLKOUT1: U1.E21(CLKOUT1) ; off-sheet CLKOUT1
CLKOUT2: U1.F21(CLKOUT2) ; off-sheet CLKOUT2
JTAG_MOD: R23.1 U1.D18(JTAG_MOD)
JTAG_TCK: R18.1 TP4.1(Pin1) U1.D21(JTAG_TCK) ; off-sheet JTAG_TCK
JTAG_TDI: U1.C21(JTAG_TDI) ; off-sheet JTAG_TDI
JTAG_TDO: U1.D20(JTAG_TDO) ; off-sheet JTAG_TDO
JTAG_TMS: R27.2 ; off-sheet JTAG_TMS
JTAG_TMS_R: R27.1 U1.E18(JTAG_TMS)
ONOFF: R21.2 TP7.1(TP) U1.E14(ONOFF) ; off-sheet ONOFF
PMIC_ON_REQ: R217.2 TP6.1(TP) U1.E16(PMIC_ON_REQ) ; off-sheet PMIC_ON_REQ
PMIC_STBY_REQ: TP10.1(TP) U1.A19(PMIC_STBY_REQ) ; off-sheet PMIC_STBY_REQ
POR_B: R20.2 TP9.1(TP) U1.A18(POR_B) ; off-sheet POR_B
RTC_RESET_B: R102.2 TP8.1(TP) U1.B18(RTC_RESET_B) ; off-sheet RTC_RESET_B
TS_RES_EXT: R103.1 U1.D16(TSENSOR_RES_EXT)
XTALI_24M: C123.1 R26.1 TP38.1(Pin1) U1.B21(24M_XTALI) Y1.3
XTALI_32K: R100.2 TP39.1(Pin1) U1.A20(RTC_XTALI)
XTALO_24M: C124.1 R26.2 U1.C20(24M_XTALO) Y1.1
XTALO_32K: R113.2 U1.B19(RTC_XTALO)

Not connected (* = marked no-connect by the designer): TP2 1(Pin1)*; TP3 1(Pin1)*; TP5 1(Pin1)*

### Notes on the sheet
- i.MX8M Nano MISC
- JTAG Debug
- # System On/Off Button
- PD
- PU
- Recommend to use external clock source,
  XTALO must be connected to NVCC_SNVS_1V8/2, or VDD_SNVS_0V8!
- (near U1) Signal Naming:
- Refer to datasheet
- TEST_MODE
- JTAG_nTRST
- Net Name
- I.MX8M Mini
- BOOT_MODE2
- I.MX8M Nano
- BOOT_MODE3
- JTAG_TMS pin must be connected with a 50ohm series
  resistor near the component if used or fanout.
- (in symbol MIMX8MN, part K) MISC

### Library data of the parts
C123 = CAP_NP: CAP CER 12PF 25V 5% C0G AEC-Q200 0201; CLASS: DISCRETE; FPLIST: CC0201,CC0201_HD,0201_CC; CAD_APPROVED: Yes; MFG_PN01: CGA1A2C0G1E120J030BA; MFG_NAME01: TDK; AGILE_PN: 150-79813; HEIGHT: 0.33MM; ROHS: Yes; Tolerance: 5%
C124 = CAP_NP: CAP CER 12PF 25V 5% C0G AEC-Q200 0201; CLASS: DISCRETE; AGILE_PN: 150-79813; MFG_NAME01: TDK; MFG_PN01: CGA1A2C0G1E120J030BA; CAD_APPROVED: Yes; FPLIST: CC0201,CC0201_HD,0201_CC; Tolerance: 5%; ROHS: Yes; HEIGHT: 0.33MM
R18 = RES: as R3 on sheet Page05 DDR4L+eMMC; Tolerance: 5%; ROHS: Yes; HEIGHT: 0.26 MM
R20 R21 = RES: as R219 on sheet Page06 CPU IO; Tolerance: 1%; ROHS: Yes; HEIGHT: 0.26MM
R23 = RES: as R120 on sheet Page06 CPU IO; Tolerance: 5%; ROHS: Yes; HEIGHT: 0.26 MM
R26 = RES: RES MF 510K 1/16W 5% 0402; CLASS: DISCRETE; FPLIST: RC0402_25,RC0402_HD,0402_CC; CAD_APPROVED: Yes; MFG_PN01: ERJ-2GEJ514X; MFG_NAME01: PANASONIC; AGILE_PN: 470-76166; PCB Footprint: 0402_CC; HEIGHT: 0.4 MM; ROHS: Yes; Tolerance: 5%
R27 = RES: RES MF 50 OHM 1/20W 5% 0402; CLASS: DISCRETE; AGILE_PN: 470-82494; FPLIST: RC0402_25,RC0402_HD,0402_CC; CAD_APPROVED: YES; MFG_NAME01: VISHAY; MFG_PN01: CH0402-50RJNPA; PCB Footprint: 0402_CC; Package Size: 0402 (1005 Metric); HEIGHT: 0.627MM; Tolerance: 5%; ROHS: Yes
R100 R113 = RES: RES MF ZERO OHM 1/16W 5% 0402; CLASS: DISCRETE; FPLIST: RC0402_25,RC0402_HD,RC0402_X2,0402_CC; CAD_APPROVED: Yes; MFG_PN01: RC0402JR-070RL; MFG_NAME01: YAGEO AMERICA; AGILE_PN: 470-75394; PCB Footprint: 0402_CC; HEIGHT: 0.45 MM; ROHS: Yes; Tolerance: 5%; VOLTAGE: 1/16W
R102 = RES: RES MF 100K 1/20W 1% 0201; CLASS: DISCRETE; AGILE_PN: 470-77704; MFG_NAME01: SKYMOS; MFG_PN01: RC-0201-104FT; CAD_APPROVED: Yes; FPLIST: RC0201,0201_CC; PCB Footprint: 0201_CC; Tolerance: 1%; ROHS: Yes; HEIGHT: 0.26MM
R103 R217 = RES: RES MF 100K 1/20W 1% 0201; CLASS: DISCRETE; FPLIST: RC0201,0201_CC; CAD_APPROVED: Yes; MFG_PN01: RC-0201-104FT; MFG_NAME01: SKYMOS; AGILE_PN: 470-77704; PCB Footprint: 0201_CC; HEIGHT: 0.26MM; ROHS: Yes
  R217: Tolerance: 1%
TP2 TP4 tp20 TP21 TP39 = TESTLOOP: as DAT0m on sheet Page05 DDR4L+eMMC; PCB Footprint: tpad_020; HEIGHT: 0.1MM; ROHS: Yes
TP3 TP5 TP38 = TESTLOOP: as CLKm on sheet Page05 DDR4L+eMMC; PCB Footprint: tpad_020; ROHS: Yes; HEIGHT: 0.1MM
TP6 TP9 = T POINT R: TEST POINT PAD .035 SMT, no part to order; ASSY_OPT: DNP; CLASS: IC; PCB Footprint: testpoint_35mil; AGILE_PN: 510-75618; CAD_APPROVED: Yes; ROHS: Yes; HEIGHT: 0.1MM
TP7 TP8 TP10 = T POINT R: TEST POINT PAD .035 SMT, no part to order; ASSY_OPT: DNP; CLASS: IC; PCB Footprint: testpoint_35mil; CAD_APPROVED: Yes; AGILE_PN: 510-75618; HEIGHT: 0.1MM; ROHS: Yes
U1 = MIMX8MN: as U1 on sheet Page05 DDR4L+eMMC; CLASS: IC; MFG_PN01: MIMX8MN5CVPIZAA; ROHS: Yes; HEIGHT: 1.01MM
Y1 = XTAL_13: XTAL 24MHZ 9pF -- SMT 3.2X2.5MM; CLASS: IC; AGILE_PN: 230-77392; MFG_NAME01: EPSON TOYOCOM CORPORATION; MFG_PN01: TSX-3225 24.0000MF15X-AC3; CAD_APPROVED: Yes; PCB Footprint: xtlosc4_3p2x2p5mm_sm; ROHS: Yes; HEIGHT: 0.60MM